# EAGLE design main_brd (EAGLE 6.4)
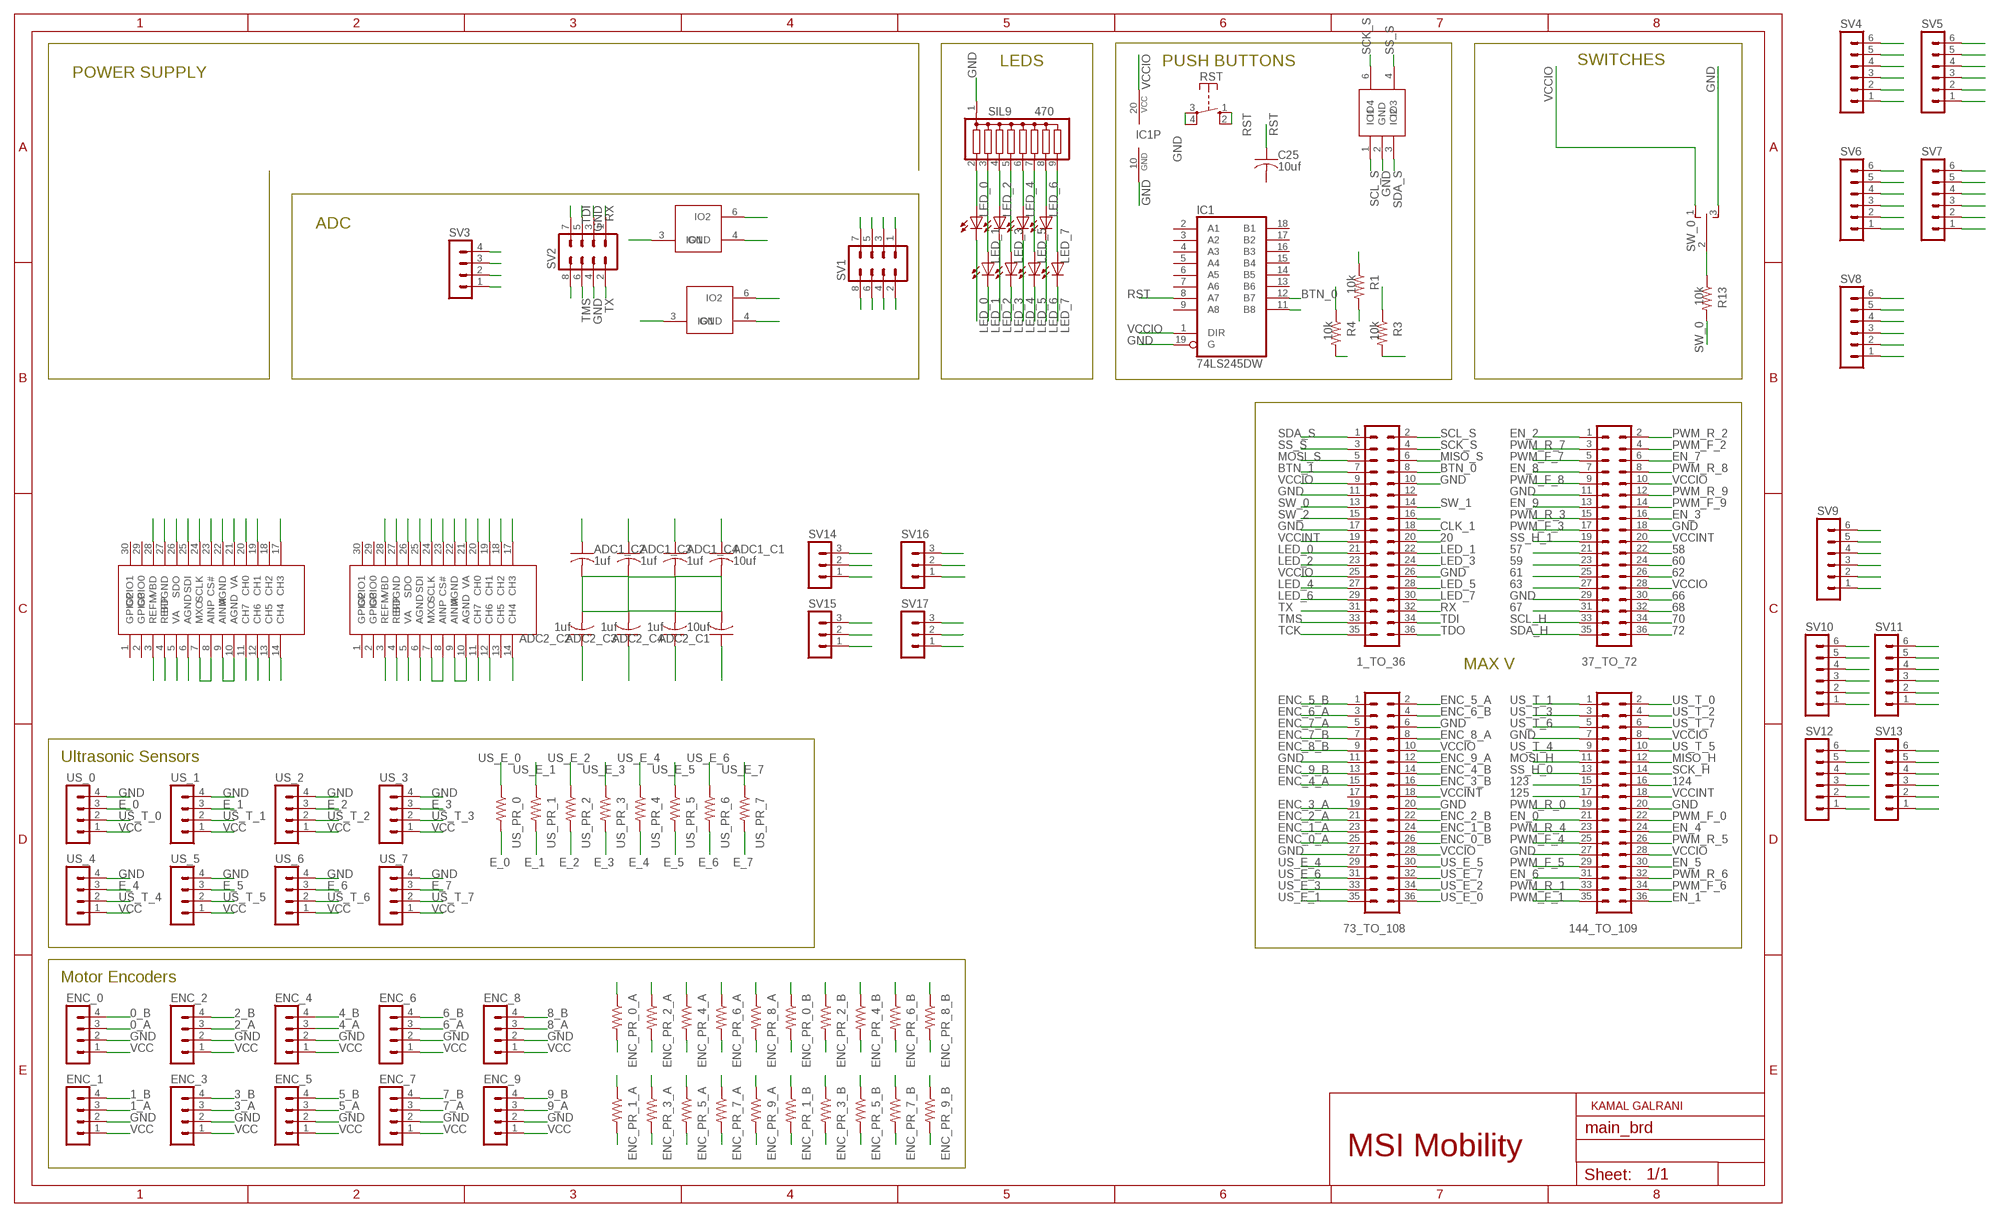
[diagram p0: schematic, sheet 1, part 1 of 2]
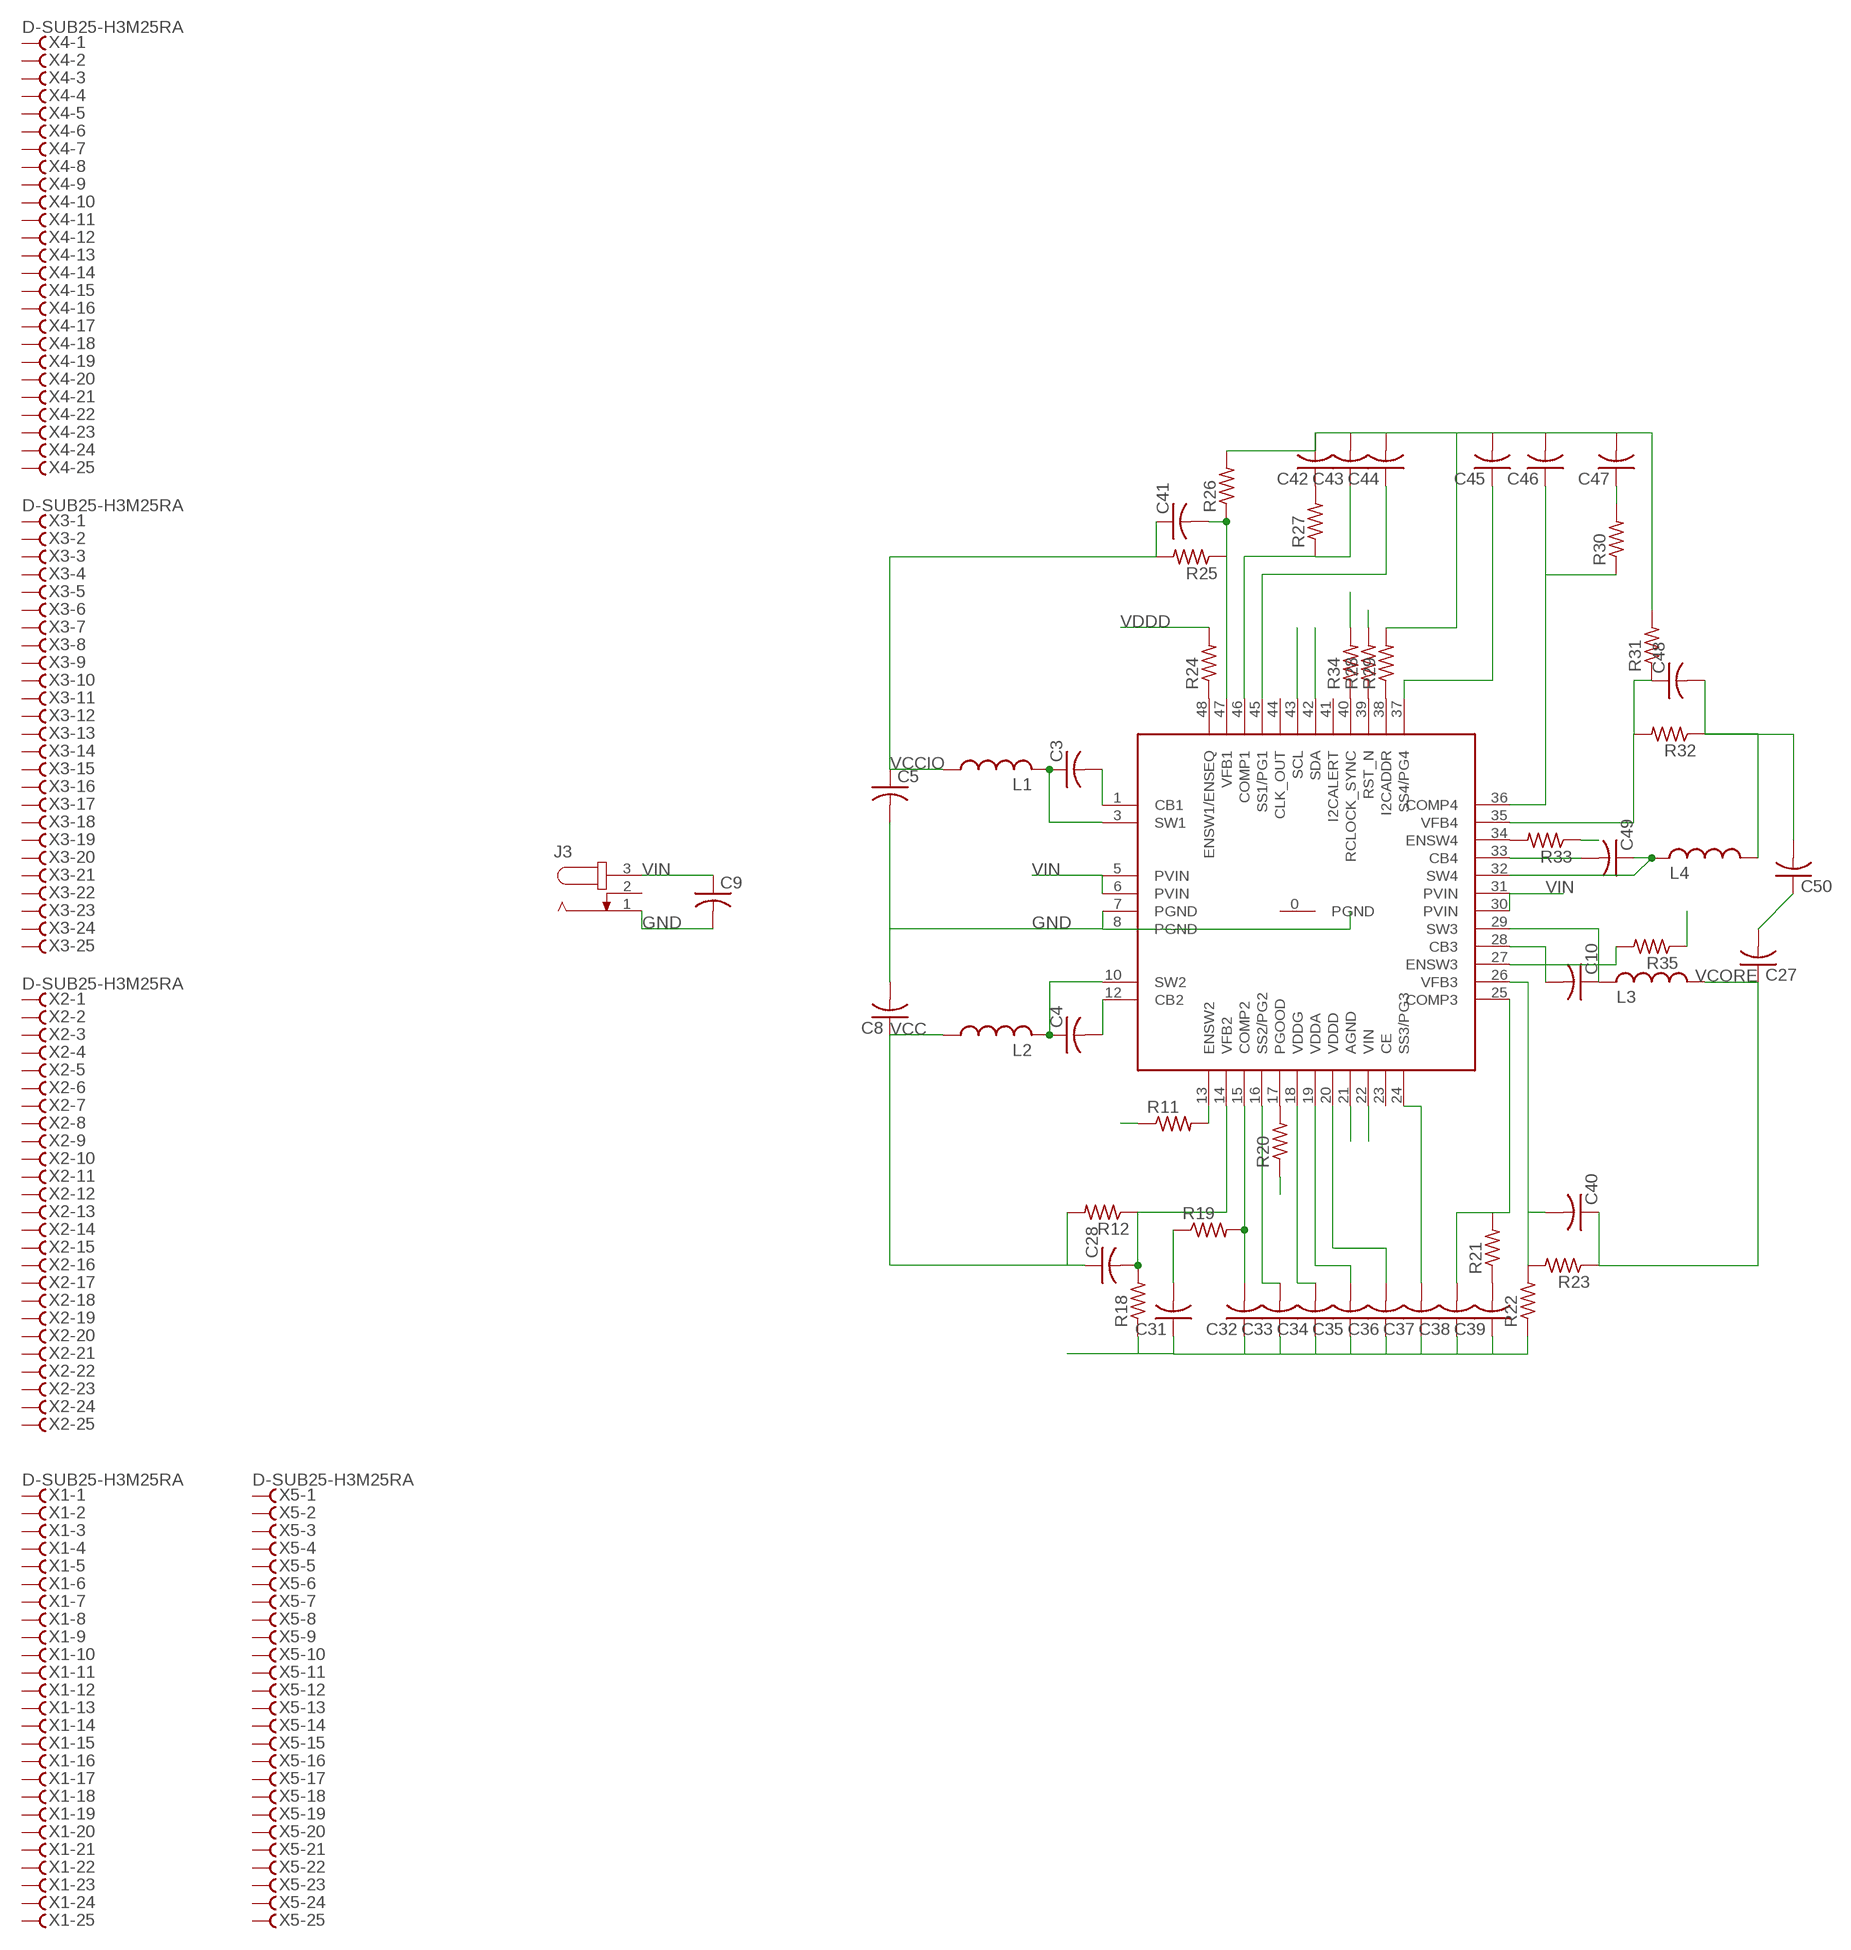
[diagram p1: schematic, sheet 1, part 2 of 2]

## Parts
1_TO_36  MA18-2  [MA18-2]
37_TO_72  MA18-2  [MA18-2]
73_TO_108  MA18-2  [MA18-2]
144_TO_109  MA18-2  [MA18-2]
ADC1_C1  10uf  C-USC1206  [C1206]
ADC1_C2  1uf  C-USC1206  [C1206]
ADC1_C3  1uf  C-USC1206  [C1206]
ADC1_C4  1uf  C-USC1206  [C1206]
ADC2_C1  10uf  C-USC1206  [C1206]
ADC2_C2  1uf  C-USC1206  [C1206]
ADC2_C3  1uf  C-USC1206  [C1206]
ADC2_C4  1uf  C-USC1206  [C1206]
C3  C-USC1206  [C1206]
C4  C-USC1206  [C1206]
C5  C-USC1206  [C1206]
C8  C-USC1206  [C1206]
C9  C-USC1206  [C1206]
C10  C-USC1206  [C1206]
C25  10uf  C-USC1206  [C1206]
C27  C-USC1206  [C1206]
C28  C-USC1206  [C1206]
C31  C-USC1206  [C1206]
C32  C-USC1206  [C1206]
C33  C-USC1206  [C1206]
C34  C-USC1206  [C1206]
C35  C-USC1206  [C1206]
C36  C-USC1206  [C1206]
C37  C-USC1206  [C1206]
C38  C-USC1206  [C1206]
C39  C-USC1206  [C1206]
C40  C-USC1206  [C1206]
C41  C-USC1206  [C1206]
C42  C-USC1206  [C1206]
C43  C-USC1206  [C1206]
C44  C-USC1206  [C1206]
C45  C-USC1206  [C1206]
C46  C-USC1206  [C1206]
C47  C-USC1206  [C1206]
C48  C-USC1206  [C1206]
C49  C-USC1206  [C1206]
C50  C-USC1206  [C1206]
ENC_0  MA04-1  [MA04-1]
ENC_1  MA04-1  [MA04-1]
ENC_2  MA04-1  [MA04-1]
ENC_3  MA04-1  [MA04-1]
ENC_4  MA04-1  [MA04-1]
ENC_5  MA04-1  [MA04-1]
ENC_6  MA04-1  [MA04-1]
ENC_7  MA04-1  [MA04-1]
ENC_8  MA04-1  [MA04-1]
ENC_9  MA04-1  [MA04-1]
ENC_PR_0_A  R-US_R1206  [R1206]
ENC_PR_0_B  R-US_R1206  [R1206]
ENC_PR_1_A  R-US_R1206  [R1206]
ENC_PR_1_B  R-US_R1206  [R1206]
ENC_PR_2_A  R-US_R1206  [R1206]
ENC_PR_2_B  R-US_R1206  [R1206]
ENC_PR_3_A  R-US_R1206  [R1206]
ENC_PR_3_B  R-US_R1206  [R1206]
ENC_PR_4_A  R-US_R1206  [R1206]
ENC_PR_4_B  R-US_R1206  [R1206]
ENC_PR_5_A  R-US_R1206  [R1206]
ENC_PR_5_B  R-US_R1206  [R1206]
ENC_PR_6_A  R-US_R1206  [R1206]
ENC_PR_6_B  R-US_R1206  [R1206]
ENC_PR_7_A  R-US_R1206  [R1206]
ENC_PR_7_B  R-US_R1206  [R1206]
ENC_PR_8_A  R-US_R1206  [R1206]
ENC_PR_8_B  R-US_R1206  [R1206]
ENC_PR_9_A  R-US_R1206  [R1206]
ENC_PR_9_B  R-US_R1206  [R1206]
IC1  74LS245DW  [SO20W]
J3  JACK-PLUG0  [SPC4077]
L1  L-USL1206  [C1206]
L2  L-USL1206  [C1206]
L3  L-USL1206  [C1206]
L4  L-USL1206  [C1206]
LED_0  LEDSMT1206  [1206]
LED_1  LEDSMT1206  [1206]
LED_2  LEDSMT1206  [1206]
LED_3  LEDSMT1206  [1206]
LED_4  LEDSMT1206  [1206]
LED_5  LEDSMT1206  [1206]
LED_6  LEDSMT1206  [1206]
LED_7  LEDSMT1206  [1206]
R1  10k  R-US_R1206  [R1206]
R3  10k  R-US_R1206  [R1206]
R4  10k  R-US_R1206  [R1206]
R11  R-US_R1206  [R1206]
R12  R-US_R1206  [R1206]
R13  10k  R-US_R1206  [R1206]
R18  R-US_R1206  [R1206]
R19  R-US_R1206  [R1206]
R20  R-US_R1206  [R1206]
R21  R-US_R1206  [R1206]
R22  R-US_R1206  [R1206]
R23  R-US_R1206  [R1206]
R24  R-US_R1206  [R1206]
R25  R-US_R1206  [R1206]
R26  R-US_R1206  [R1206]
R27  R-US_R1206  [R1206]
R28  R-US_R1206  [R1206]
R29  R-US_R1206  [R1206]
R30  R-US_R1206  [R1206]
R31  R-US_R1206  [R1206]
R32  R-US_R1206  [R1206]
R33  R-US_R1206  [R1206]
R34  R-US_R1206  [R1206]
R35  R-US_R1206  [R1206]
RST  RACON12  [RACON12]
SIL9  470  G08R  [SIL9]
SV1  MA04-2  [MA04-2]
SV2  MA04-2  [MA04-2]
SV3  MA04-1  [MA04-1]
SV4  MA06-1  [MA06-1]
SV5  MA06-1  [MA06-1]
SV6  MA06-1  [MA06-1]
SV7  MA06-1  [MA06-1]
SV8  MA06-1  [MA06-1]
SV9  MA06-1  [MA06-1]
SV10  MA06-1  [MA06-1]
SV11  MA06-1  [MA06-1]
SV12  MA06-1  [MA06-1]
SV13  MA06-1  [MA06-1]
SV14  MA03-1  [MA03-1]
SV15  MA03-1  [MA03-1]
SV16  MA03-1  [MA03-1]
SV17  MA03-1  [MA03-1]
SW_0  TL39PO  [TL3XPO]
U$1  TPD4E1B06DCKR  [DCK6]
U$2  TPS65400RGZR  [VQFN48]
U$3  ADS7955-Q1-DBTR  [DBT_R-PDSO-G30]
U$4  TPD2E2U06DRLR  [DRL5]
U$5  TPD2E2U06DRLR  [DRL5]
U$6  ADS7955-Q1-DBTR  [DBT_R-PDSO-G30]
US_0  MA04-1  [MA04-1]
US_1  MA04-1  [MA04-1]
US_2  MA04-1  [MA04-1]
US_3  MA04-1  [MA04-1]
US_4  MA04-1  [MA04-1]
US_5  MA04-1  [MA04-1]
US_6  MA04-1  [MA04-1]
US_7  MA04-1  [MA04-1]
US_PR_0  R-US_R1206  [R1206]
US_PR_1  R-US_R1206  [R1206]
US_PR_2  R-US_R1206  [R1206]
US_PR_3  R-US_R1206  [R1206]
US_PR_4  R-US_R1206  [R1206]
US_PR_5  R-US_R1206  [R1206]
US_PR_6  R-US_R1206  [R1206]
US_PR_7  R-US_R1206  [R1206]
X1  D-SUB25-H3M25RA  [H3M25RA]
X2  D-SUB25-H3M25RA  [H3M25RA]
X3  D-SUB25-H3M25RA  [H3M25RA]
X4  D-SUB25-H3M25RA  [H3M25RA]
X5  D-SUB25-H3M25RA  [H3M25RA]

## Nets
0_A: ENC_0.3 ENC_PR_0_A.2
0_B: ENC_0.4 ENC_PR_0_B.2
1_A: ENC_1.3 ENC_PR_1_A.2
1_B: ENC_1.4 ENC_PR_1_B.2
2_A: ENC_2.3 ENC_PR_2_A.2
2_B: ENC_2.4 ENC_PR_2_B.2
3_A: ENC_3.3 ENC_PR_3_A.2
3_B: ENC_3.4 ENC_PR_3_B.2
4_A: ENC_4.3 ENC_PR_4_A.2
4_B: ENC_4.4 ENC_PR_4_B.2
5_A: ENC_5.3 ENC_PR_5_A.2
5_B: ENC_5.4 ENC_PR_5_B.2
6_A: ENC_6.3 ENC_PR_6_A.2
6_B: ENC_6.4 ENC_PR_6_B.2
7_A: ENC_7.3 ENC_PR_7_A.2
7_B: ENC_7.4 ENC_PR_7_B.2
8_A: ENC_8.3 ENC_PR_8_A.2
8_B: ENC_8.4 ENC_PR_8_B.2
9_A: ENC_9.3 ENC_PR_9_A.2
9_B: ENC_9.4 ENC_PR_9_B.2
20: 1_TO_36.20
57: 37_TO_72.21
58: 37_TO_72.22
59: 37_TO_72.23
60: 37_TO_72.24
61: 37_TO_72.25
62: 37_TO_72.26
63: 37_TO_72.27
66: 37_TO_72.30
67: 37_TO_72.31
68: 37_TO_72.32
70: 37_TO_72.34
72: 37_TO_72.36
123: 144_TO_109.15
124: 144_TO_109.16
125: 144_TO_109.17
BTN: U$4.6(IO2)
BTN_0: 1_TO_36.8 IC1.12(B7)
BTN_1: 1_TO_36.7 IC1.11(B8)
CLK_1: 1_TO_36.18
CS_0: SV9.4 U$3.11(CH7)
CS_1: SV13.4 U$3.17(CH3)
CS_2: SV4.4 U$6.14(CH4)
CS_3: SV8.4 U$6.20(CH0)
CS_4: SV10.4 U$3.12(CH6)
CS_5: SV11.4 U$3.13(CH5)
CS_6: SV12.4 U$3.14(CH4)
CS_7: SV5.4 U$6.17(CH3)
CS_8: SV6.4 U$6.18(CH2)
CS_9: SV7.4 U$6.19(CH1)
E_0: US_0.3 US_PR_0.2
E_1: US_1.3 US_PR_1.2
E_2: US_2.3 US_PR_2.2
E_3: US_3.3 US_PR_3.2
E_4: US_4.3 US_PR_4.2
E_5: US_5.3 US_PR_5.2
E_6: US_6.3 US_PR_6.2
E_7: US_7.3 US_PR_7.2
EN_0: 144_TO_109.21 SV9.2
EN_1: 144_TO_109.36 SV13.2
EN_2: 37_TO_72.1 SV4.2
EN_3: 37_TO_72.16 SV8.2
EN_4: 144_TO_109.24 SV10.2
EN_5: 144_TO_109.30 SV11.2
EN_6: 144_TO_109.31 SV12.2
EN_7: 37_TO_72.6 SV5.2
EN_8: 37_TO_72.7 SV6.2
EN_9: 37_TO_72.13 SV7.2
ENC_0_A: 73_TO_108.25 ENC_PR_0_A.1
ENC_0_B: 73_TO_108.26 ENC_PR_0_B.1
ENC_1_A: 73_TO_108.23 ENC_PR_1_A.1
ENC_1_B: 73_TO_108.24 ENC_PR_1_B.1
ENC_2_A: 73_TO_108.21 ENC_PR_2_A.1
ENC_2_B: 73_TO_108.22 ENC_PR_2_B.1
ENC_3_A: 73_TO_108.19 ENC_PR_3_A.1
ENC_3_B: 73_TO_108.16 ENC_PR_3_B.1
ENC_4_A: 73_TO_108.15 ENC_PR_4_A.1
ENC_4_B: 73_TO_108.14 ENC_PR_4_B.1
ENC_5_A: 73_TO_108.2 ENC_PR_5_A.1
ENC_5_B: 73_TO_108.1 ENC_PR_5_B.1
ENC_6_A: 73_TO_108.3 ENC_PR_6_A.1
ENC_6_B: 73_TO_108.4 ENC_PR_6_B.1
ENC_7_A: 73_TO_108.5 ENC_PR_7_A.1
ENC_7_B: 73_TO_108.7 ENC_PR_7_B.1
ENC_8_A: 73_TO_108.8 ENC_PR_8_A.1
ENC_8_B: 73_TO_108.9 ENC_PR_8_B.1
ENC_9_A: 73_TO_108.12 ENC_PR_9_A.1
ENC_9_B: 73_TO_108.13 ENC_PR_9_B.1
ENSW3: R35.2 U$2.27(ENSW3)
ENSW4: R33.2 U$2.34(ENSW4)
GND: 1_TO_36.10 1_TO_36.11 1_TO_36.17 1_TO_36.26 37_TO_72.11 37_TO_72.18 37_TO_72.29 73_TO_108.6 73_TO_108.11 73_TO_108.20 73_TO_108.27 144_TO_109.7 144_TO_109.20 144_TO_109.27 ADC1_C1.2 ADC1_C2.2 ADC1_C3.2 ADC1_C4.2 ADC2_C1.2 ADC2_C2.2 ADC2_C3.2 ADC2_C4.2 C5.2 C8.2 C9.2 C27.2 C31.1 C32.1 C33.1 C34.1 C35.1 C36.1 C37.1 C38.1 C39.1 C42.2 C43.2 C44.2 C45.2 C46.2 C47.2 ENC_0.2 ENC_1.2 ENC_2.2 ENC_3.2 ENC_4.2 ENC_5.2 ENC_6.2 ENC_7.2 ENC_8.2 ENC_9.2 IC1.10(GND) IC1.19(G) J3.1 R18.1 R22.1 R26.2 R29.2 R31.2 R34.2 RST.3(P) RST.4(P) SIL9.1 SV1.7 SV1.8 SV2.3 SV2.4 SV3.2 SV14.3 SV15.3 SV16.3 SV17.3 SW_0.3(S) U$1.2(GND) U$2.7(PGND) U$2.8(PGND) U$2.21(AGND) U$3.3(REFM) U$3.6(AGND) U$3.9(AINM) U$3.10(AGND) U$3.22(AGND) U$3.27(BDGND) U$4.4(GND) U$5.4(GND) U$6.3(REFM) U$6.6(AGND) U$6.9(AINM) U$6.10(AGND) U$6.22(AGND) U$6.27(BDGND) US_0.4 US_1.4 US_2.4 US_3.4 US_4.4 US_5.4 US_6.4 US_7.4
LED_0: 1_TO_36.21 LED_0.C
LED_1: 1_TO_36.22 LED_1.C
LED_2: 1_TO_36.23 LED_2.C
LED_3: 1_TO_36.24 LED_3.C
LED_4: 1_TO_36.27 LED_4.C
LED_5: 1_TO_36.28 LED_5.C
LED_6: 1_TO_36.29 LED_6.C
LED_7: 1_TO_36.30 LED_7.C
MISO_H: 144_TO_109.12 U$3.26(SDO) U$6.26(SDO)
MISO_S: 1_TO_36.6 SV1.5 U$5.3(IO1)
MOSI_H: 144_TO_109.11 U$3.25(SDI) U$6.25(SDI)
MOSI_S: 1_TO_36.5 SV1.6 U$5.6(IO2)
MXO_0: U$3.7(MXO) U$3.8(AINP)
MXO_1: U$6.7(MXO) U$6.8(AINP)
N$1: SV13.6
N$3: C4.1 L2.2 U$2.10(SW2)
N$4: SV4.6
N$5: SV11.6
N$8: SV12.6
N$10: C3.2 U$2.1(CB1)
N$11: C3.1 L1.2 U$2.3(SW1)
N$12: C4.2 U$2.12(CB2)
N$13: C10.1 L3.2 U$2.29(SW3)
N$14: C10.2 U$2.28(CB3)
N$16: R11.2 U$2.13(ENSW2)
N$17: C28.2 R12.1 R18.2 U$2.14(VFB2)
N$18: C32.2 R19.2 U$2.15(COMP2)
N$19: LED_0.A SIL9.2
N$21: LED_4.A SIL9.6
N$22: LED_6.A SIL9.8
N$23: LED_1.A SIL9.3
N$24: LED_3.A SIL9.5
N$25: LED_5.A SIL9.7
N$26: LED_7.A SIL9.9
N$27: C31.2 R19.1
N$28: R13.1 SW_0.2(P)
N$29: R20.2 U$2.17(PGOOD)
N$35: C34.2 U$2.18(VDDG)
N$36: C35.2 U$2.19(VDDA)
N$37: C39.2 R21.1
N$38: C40.2 R22.2 R23.2 U$2.26(VFB3)
N$39: C38.2 R21.2 U$2.25(COMP3)
N$40: R24.1 U$2.48(ENSW1/ENSEQ)
N$41: C37.2 U$2.24(SS3/PG3)
N$44: C33.2 U$2.16(SS2/PG2)
N$47: C42.1 R27.2
N$48: SV8.6
N$54: R29.1 U$2.38(I2CADDR)
N$55: C48.1 R31.1 R32.2 U$2.35(VFB4)
N$57: C49.1 L4.2 U$2.32(SW4)
N$58: C41.2 R25.1 R26.1 U$2.47(VFB1)
N$59: C45.1 U$2.37(SS4/PG4)
N$60: C46.1 R30.1 U$2.36(COMP4)
N$61: C47.1 R30.2
N$62: C43.1 R27.1 U$2.46(COMP1)
N$63: C44.1 U$2.45(SS1/PG1)
N$64: SV9.6
N$65: C49.2 U$2.33(CB4)
N$66: R34.1 U$2.40(RCLOCK_SYNC)
N$69: SV6.6
N$72: SV10.6
N$82: SV7.6
N$88: SV5.6
POT_0: SV14.2 U$3.20(CH0)
POT_1: SV15.2 U$3.19(CH1)
POT_2: SV16.2 U$6.11(CH7)
POT_3: SV17.2 U$6.12(CH6)
PWM_F_0: 144_TO_109.22 SV9.1
PWM_F_1: 144_TO_109.35 SV13.1
PWM_F_2: 37_TO_72.4 SV4.1
PWM_F_3: 37_TO_72.17 SV8.1
PWM_F_4: 144_TO_109.25 SV10.1
PWM_F_5: 144_TO_109.29 SV11.1
PWM_F_6: 144_TO_109.34 SV12.1
PWM_F_7: 37_TO_72.5 SV5.1
PWM_F_8: 37_TO_72.9 SV6.1
PWM_F_9: 37_TO_72.14 SV7.1
PWM_R_0: 144_TO_109.19 SV9.3
PWM_R_1: 144_TO_109.33 SV13.3
PWM_R_2: 37_TO_72.2 SV4.3
PWM_R_3: 37_TO_72.15 SV8.3
PWM_R_4: 144_TO_109.23 SV10.3
PWM_R_5: 144_TO_109.26 SV11.3
PWM_R_6: 144_TO_109.32 SV12.3
PWM_R_7: 37_TO_72.3 SV5.3
PWM_R_8: 37_TO_72.8 SV6.3
PWM_R_9: 37_TO_72.12 SV7.3
REFP_0: ADC1_C1.1 U$3.4(REFP)
REFP_1: ADC2_C1.1 U$6.4(REFP)
RST: C25.1 IC1.8(A7) R1.1 RST.1(S) RST.2(S) U$4.3(IO1)
RST_N: R28.1 U$2.39(RST_N)
RX: 1_TO_36.32 SV2.1 SV3.3
SCK_H: 144_TO_109.14 U$3.24(SCLK) U$6.24(SCLK)
SCK_S: 1_TO_36.4 SV1.3 U$1.6(IO4)
SCL_H: 37_TO_72.33
SCL_S: 1_TO_36.2 R4.1 SV1.1 U$1.1(IO1) U$2.43(SCL)
SDA_H: 37_TO_72.35
SDA_S: 1_TO_36.1 R3.1 SV1.2 U$1.3(IO2) U$2.42(SDA)
SIL10: LED_2.A SIL9.4
SS_H_0: 144_TO_109.13 U$3.23(CS#)
SS_H_1: 37_TO_72.19 U$6.23(CS#)
SS_S: 1_TO_36.3 SV1.4 U$1.4(IO3)
SW_0: 1_TO_36.13 R13.2
SW_1: 1_TO_36.14
SW_2: 1_TO_36.15
SW_3: 1_TO_36.16
TCK: 1_TO_36.35 SV2.8
TDI: 1_TO_36.34 SV2.5
TDO: 1_TO_36.36 SV2.7
TMS: 1_TO_36.33 SV2.6
TX: 1_TO_36.31 SV2.2 SV3.1
US_E_0: 73_TO_108.36 US_PR_0.1
US_E_1: 73_TO_108.35 US_PR_1.1
US_E_2: 73_TO_108.34 US_PR_2.1
US_E_3: 73_TO_108.33 US_PR_3.1
US_E_4: 73_TO_108.29 US_PR_4.1
US_E_5: 73_TO_108.30 US_PR_5.1
US_E_6: 73_TO_108.31 US_PR_6.1
US_E_7: 73_TO_108.32 US_PR_7.1
US_T_0: 144_TO_109.2 US_0.2
US_T_1: 144_TO_109.1 US_1.2
US_T_2: 144_TO_109.4 US_2.2
US_T_3: 144_TO_109.3 US_3.2
US_T_4: 144_TO_109.9 US_4.2
US_T_5: 144_TO_109.10 US_5.2
US_T_6: 144_TO_109.5 US_6.2
US_T_7: 144_TO_109.6 US_7.2
VCC: ADC1_C2.1 ADC1_C3.1 ADC2_C2.1 ADC2_C3.1 C8.1 C28.1 ENC_0.1 ENC_1.1 ENC_2.1 ENC_3.1 ENC_4.1 ENC_5.1 ENC_6.1 ENC_7.1 ENC_8.1 ENC_9.1 L2.1 R12.2 SV14.1 SV15.1 SV16.1 SV17.1 U$3.5(VA) U$3.21(VA) U$6.5(VA) U$6.21(VA) US_0.1 US_1.1 US_2.1 US_3.1 US_4.1 US_5.1 US_6.1 US_7.1
VCCINT: 1_TO_36.19 37_TO_72.20 73_TO_108.18 144_TO_109.18 C48.2 C50.2 L4.1 R32.1
VCCIO: 1_TO_36.9 1_TO_36.25 37_TO_72.10 37_TO_72.28 73_TO_108.10 73_TO_108.28 144_TO_109.8 144_TO_109.28 ADC1_C4.1 ADC2_C4.1 C5.1 C41.1 IC1.1(DIR) IC1.20(VCC) L1.1 R1.2 R3.2 R4.2 R25.2 SV3.4 SV4.5 SV5.5 SV6.5 SV7.5 SV8.5 SV9.5 SV10.5 SV11.5 SV12.5 SV13.5 SW_0.1(O) U$3.28(VBD) U$6.28(VBD)
VCORE: C27.1 C40.1 L3.1 R23.1
VDDD: C36.2 R11.1 R20.1 R24.2 R28.2 R33.1 R35.1 U$2.20(VDDD)
VIN: C9.1 J3.3 U$2.5(PVIN) U$2.6(PVIN) U$2.22(VIN) U$2.30(PVIN) U$2.31(PVIN)
Unconnected: 1_TO_36.12 73_TO_108.17 C25.2 C50.1 IC1.2(A1) IC1.3(A2) IC1.4(A3) IC1.5(A4) IC1.6(A5) IC1.7(A6) IC1.9(A8) IC1.13(B6) IC1.14(B5) IC1.15(B4) IC1.16(B3) IC1.17(B2) IC1.18(B1) J3.2 U$2.0(PGND) U$2.23(CE) U$2.41(I2CALERT) U$2.44(CLK_OUT) U$3.1(GPIO2) U$3.2(GPIO3) U$3.18(CH2) U$3.29(GPIO0) U$3.30(GPIO1) U$6.1(GPIO2) U$6.2(GPIO3) U$6.13(CH5) U$6.29(GPIO0) U$6.30(GPIO1) X1.1 X1.2 X1.3 X1.4 X1.5 X1.6 X1.7 X1.8 X1.9 X1.10 X1.11 X1.12 X1.13 X1.14 X1.15 X1.16 X1.17 X1.18 X1.19 X1.20 X1.21 X1.22 X1.23 X1.24 X1.25 X2.1 X2.2 X2.3 X2.4 X2.5 X2.6 X2.7 X2.8 X2.9 X2.10 X2.11 X2.12 X2.13 X2.14 X2.15 X2.16 X2.17 X2.18 X2.19 X2.20 X2.21 X2.22 X2.23 X2.24 X2.25 X3.1 X3.2 X3.3 X3.4 X3.5 X3.6 X3.7 X3.8 X3.9 X3.10 X3.11 X3.12 X3.13 X3.14 X3.15 X3.16 X3.17 X3.18 X3.19 X3.20 X3.21 X3.22 X3.23 X3.24 X3.25 X4.1 X4.2 X4.3 X4.4 X4.5 X4.6 X4.7 X4.8 X4.9 X4.10 X4.11 X4.12 X4.13 X4.14 X4.15 X4.16 X4.17 X4.18 X4.19 X4.20 X4.21 X4.22 X4.23 X4.24 X4.25 X5.1 X5.2 X5.3 X5.4 X5.5 X5.6 X5.7 X5.8 X5.9 X5.10 X5.11 X5.12 X5.13 X5.14 X5.15 X5.16 X5.17 X5.18 X5.19 X5.20 X5.21 X5.22 X5.23 X5.24 X5.25

## Notes on the sheet
- LEDS | PUSH BUTTONS | SWITCHES
- POWER SUPPLY
- ADC
- MAX V
- Ultrasonic Sensors
- Motor Encoders
- KAMAL GALRANI
- MSI Mobility

## Library data of the parts
1_TO_36 37_TO_72 73_TO_108 144_TO_109 = con-lstb:MA18-2: PIN HEADER; OC_FARNELL: unknown; OC_NEWARK: unknown
ADC1_C1-ADC1_C4 ADC2_C1-ADC2_C4 C25 = resistor:C-US: CAPACITOR, American symbol
C3-C5 C8-C10 C27 C28 C31-C50 = rcl:C-US: CAPACITOR, American symbol
ENC_0 ENC_1-ENC_9 SV3 US_0 US_1-US_7 = con-lstb:MA04-1: PIN HEADER; OC_FARNELL: unknown; OC_NEWARK: unknown
ENC_PR_0_A ENC_PR_0_B ENC_PR_1_A ENC_PR_1_B ENC_PR_2_A ENC_PR_2_B ENC_PR_3_A ENC_PR_3_B ENC_PR_4_A ENC_PR_4_B ENC_PR_5_A ENC_PR_5_B ENC_PR_6_A ENC_PR_6_B ENC_PR_7_A ENC_PR_7_B ENC_PR_8_A ENC_PR_8_B ENC_PR_9_A ENC_PR_9_B R1 R3 R4 R13 US_PR_0 US_PR_1-US_PR_7 = resistor:R-US_: RESISTOR, American symbol
IC1 = 74xx-us:74*245: Octal BUS TRANSCEIVER, 3-state
J3 = con-jack:JACK-PLUG: DC POWER JACK Power Jack, DC, Right Angle, Through Hole, Rated 5A at 16VDC, PC Terminals Distributor: Farnell (www.Farnell.de) Drawing: 84N1161.pdf / 84N1162.pdf Manufacturer: SPC Technology (www.spctechnology.com) Type: SPC4077 / SPC 4078; OC_FARNELL: unknown; OC_NEWARK: unknown
L1-L4 = rcl:L-US: INDUCTOR, American symbol
LED_0 LED_1-LED_7 = led:LED: LED OSRAM: - CHIPLED LG R971, LG N971, LY N971, LG Q971, LY Q971, LO R971, LY R971 LH N974, LH R974 LS Q976, LO Q976, LY Q976 LO Q996 - Hyper CHIPLED LW Q18S LB Q993, LB Q99A, LB R99A - SideLED LS A670, LO A670, LY A670, LG A670, LP A670 LB A673, LV A673, LT A673, LW A673 LH A674 LY A675 LS A676, LA A676, LO A676, LY A676, LW A676 LS A679, LY A679, LG A679 - Hyper Micro SIDELED® LS Y876, LA Y876, LO Y876, LY Y876 LT Y87S - SmartLED LW L88C, LW L88S LB L89C, LB L89S, LG L890 LS L89K, LO L89K, LY L89K LS L896, LA L896, LO L896, LY L896 - TOPLED LS T670, LO T670, LY T670, LG T670, LP T670 LSG T670, LSP T670, LSY T670, LOP T670, LYG T670 LG T671, LOG T671, LSG T671 LB T673, LV T673, LT T673, LW T673 LH T674 LS T676, LA T676, LO T676, LY T676, LB T676, LH T676, LSB T676, LW T676 LB T67C, LV T67C, LT T67C, LS T67K, LO T67K, LY T67K, LW E67C LS E67B, LA E67B, LO E67B, LY E67B, LB E67C, LV E67C, LT E67C LW T67C LS T679, LY T679, LG T679 LS T770, LO T770, LY T770, LG T770, LP T770 LB T773, LV T773, LT T773, LW T773 LH T774 LS E675, LA E675, LY E675, LS T675 LS T776, LA T776, LO T776, LY T776, LB T776 LHGB T686 LT T68C, LB T68C - Hyper Mini TOPLED® LB M676 - Mini TOPLED Santana® LG M470 LS M47K, LO M47K, LY M47K Source: http://www.osram.convergy.de - LUMILED® LXK2-PW12-R00, LXK2-PW12-S00, LXK2-PW14-U00, LXK2-PW14-V00 LXK2-PM12-R00, LXK2-PM12-S00, LXK2-PM14-U00 LXK2-PE12-Q00, LXK2-PE12-R00, LXK2-PE12-S00, LXK2-PE14-T00, LXK2-PE14-U00 LXK2-PB12-K00, LXK2-PB12-L00, LXK2-PB12-M00, LXK2-PB14-N00, LXK2-PB14-P00, LXK2-PB14-Q00 LXK2-PR12-L00, LXK2-PR12-M00, LXK2-PR14-Q00, LXK2-PR14-R00 LXK2-PD12-Q00, LXK2-PD12-R00, LXK2-PD12-S00 LXK2-PH12-R00, LXK2-PH12-S00 LXK2-PL12-P00, LXK2-PL12-Q00, LXK2-PL12-R00 Source: www.luxeon.com
R11 R12 R18-R35 = rcl:R-US_: RESISTOR, American symbol
RST = switch-misc:RACON12: ITT SWITCH
SIL9 = resistor-sil:G08R: SIL RESISTOR
SV1 SV2 = con-lstb:MA04-2: PIN HEADER; OC_FARNELL: unknown; OC_NEWARK: unknown
SV4-SV13 = con-lstb:MA06-1: PIN HEADER; OC_FARNELL: unknown; OC_NEWARK: unknown
SV14-SV17 = con-lstb:MA03-1: PIN HEADER; OC_FARNELL: unknown; OC_NEWARK: unknown
SW_0 = switch:TL39PO: TINY SWITCH ON OFF ON Source: http://www2.produktinfo.conrad.com/datenblaetter/700000-724999/705152-da-01-de-Subminiaturschalter_TL_36YO.pdf
U$1 = ti-esd:TPD4E1B06: Texas Intstruments ESD Protection Solutions
U$2 = ti-power:TPS65400: Quad 4A/4A/2A/2A buck converter
U$3 U$6 = kamal:ADS7955-Q1
U$4 U$5 = ti-esd:TPD2E2U06: Texas Intstruments ESD Protection Solutions
X1-X5 = con-thomas-betts:D-SUB25-: D-Subminiatur Connector Source: Electronioc Interconnects European Edition 1998; OC_FARNELL: unknown; OC_NEWARK: unknown

## Board
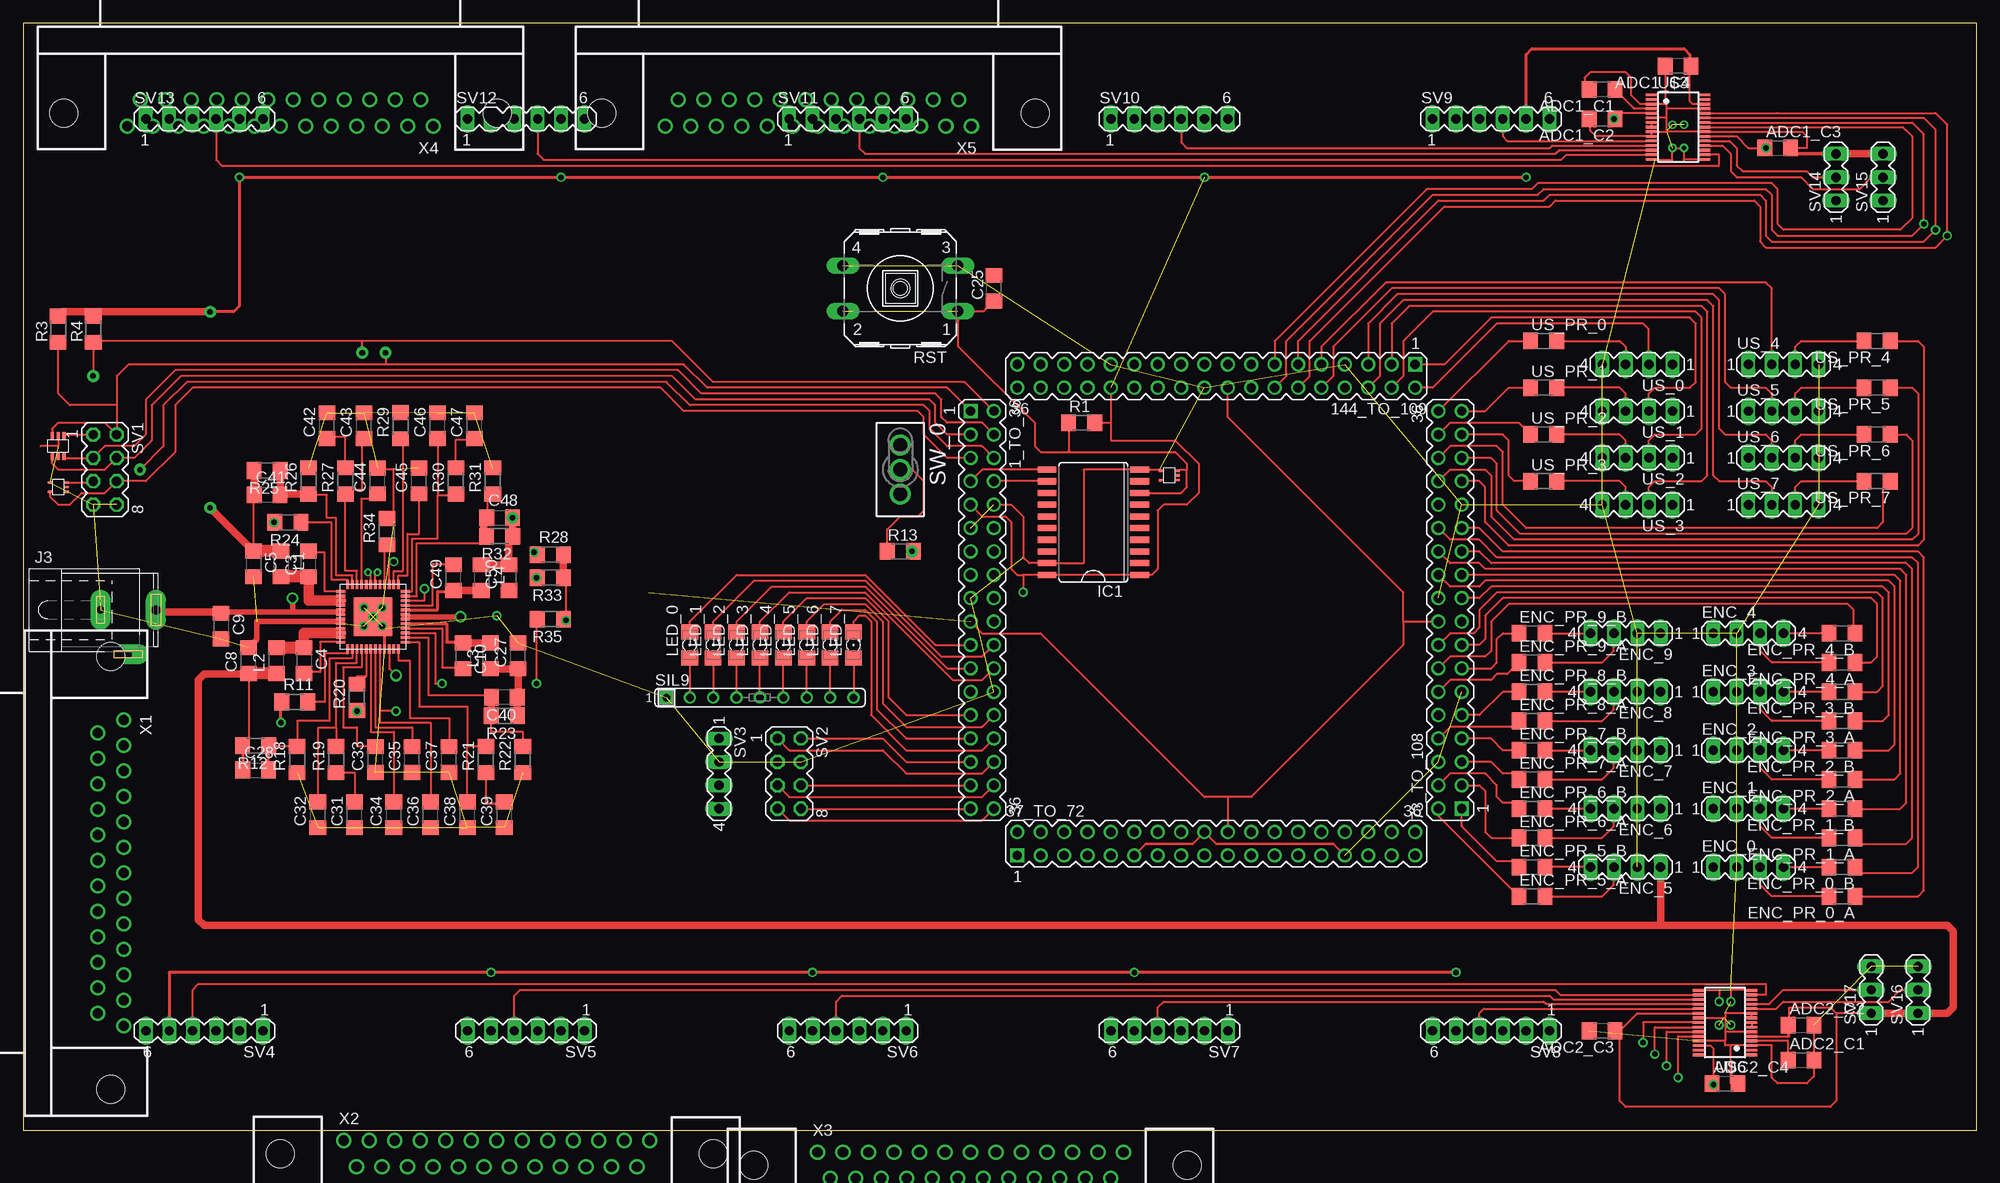
[diagram p2: board, top side]
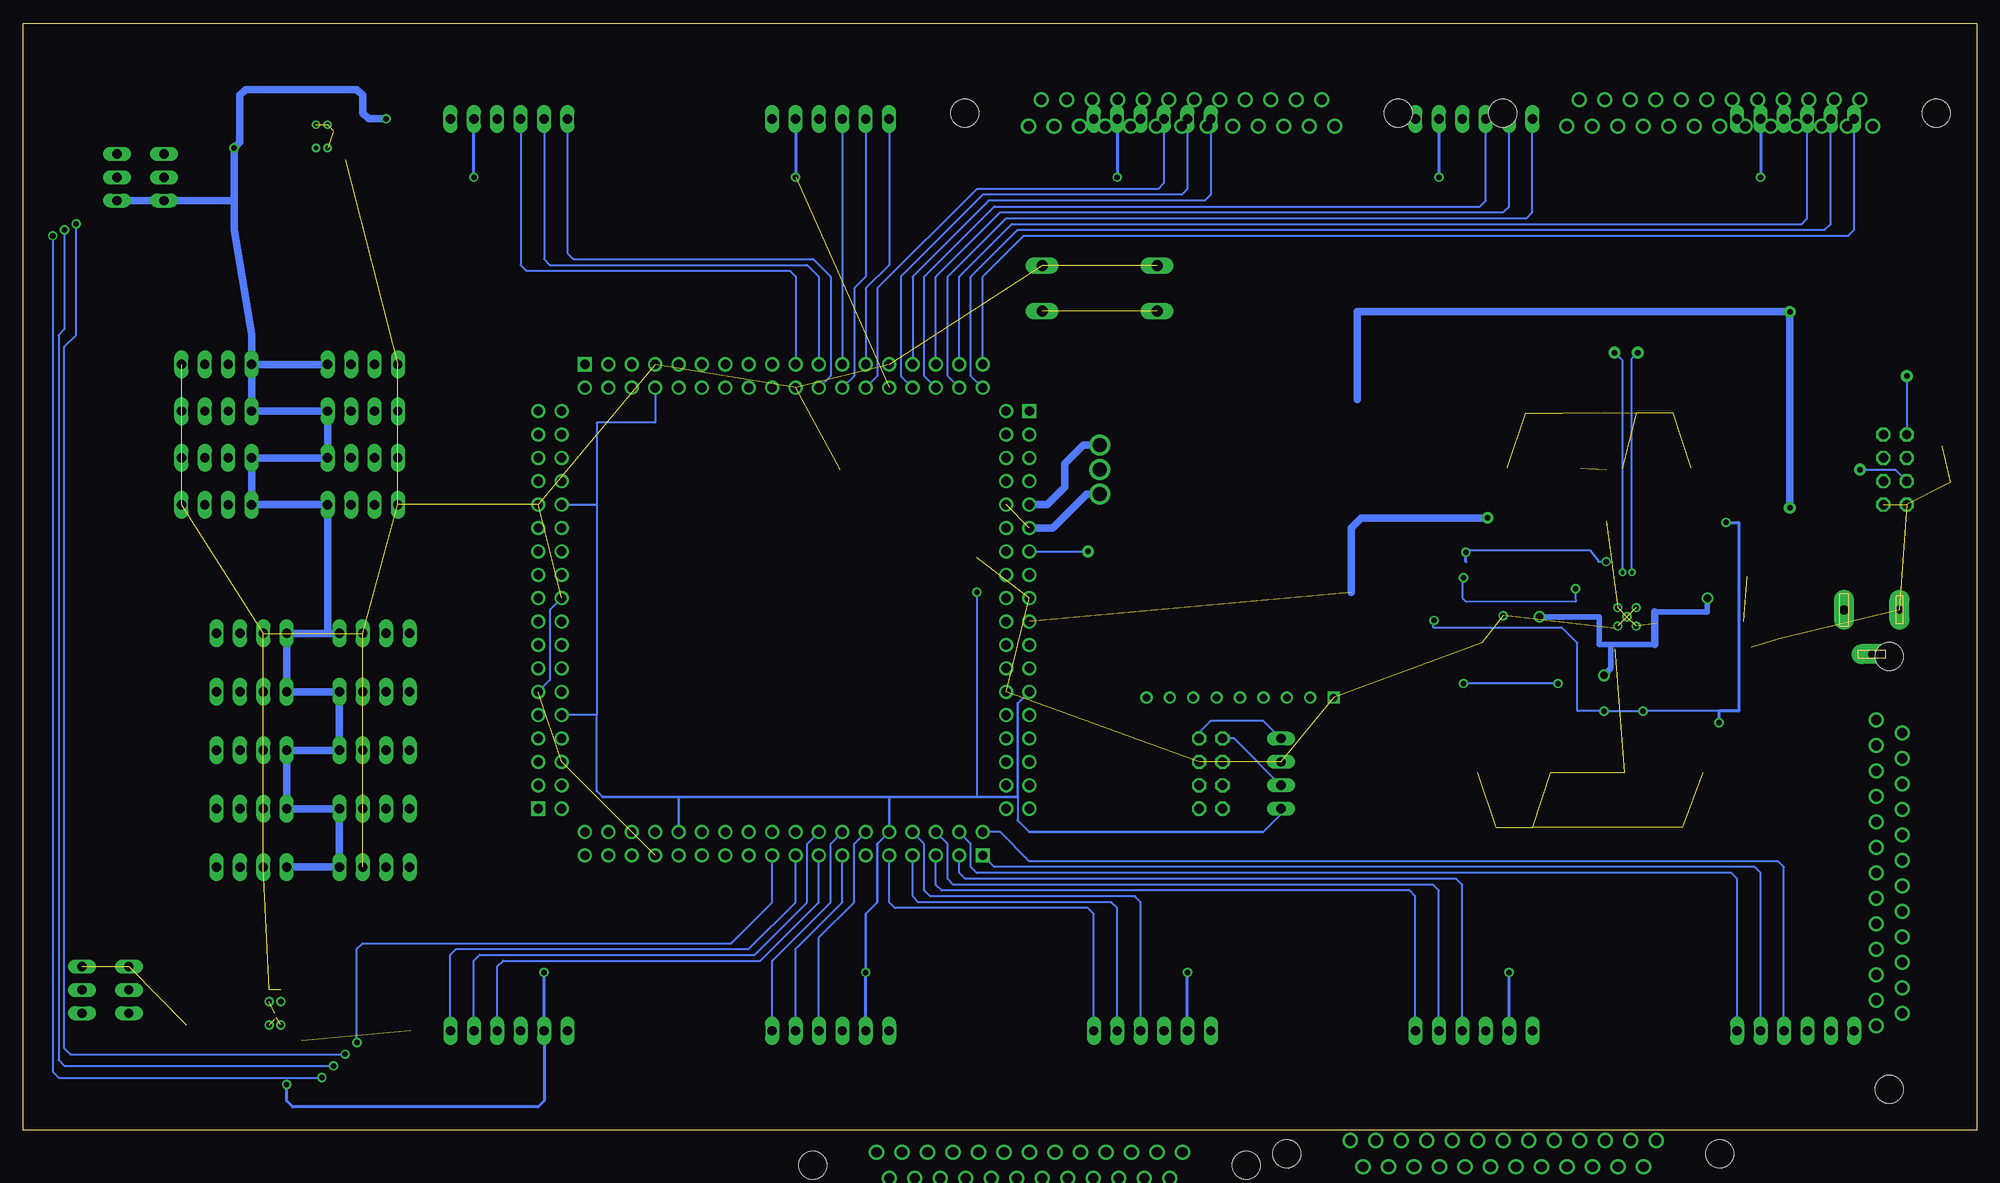
[diagram p3: board, bottom side, seen from below]

Size 212.14 x 120.26 mm. Coordinates in mm from the lower left corner, seen from the top.
Outline: 0,0 212.14,0 212.14,120.26 0,120.26 0,0
Copper layers (1*16): Top 0.035mm / dielectric 1.5mm / Bottom 0.035mm
Design rules "default": minimum track width 10mil, minimum drill 24mil, track to track 8mil, track to pad 8mil, pad to pad 8mil, via to via 8mil, smd to smd 8mil, copper to edge 40mil, drill to drill 8mil, minimum pad ring 10mil, minimum via ring 8mil, stop-mask expansion 4mil, vias tented up to drill 0mil, thermal gap 10mil

### Footprints (pad centres in the part's own frame; a part is rotated, then mirrored left to right if it is on the bottom)
MA18-2 = drill 1.016 square: 1 -21.59,-1.27 | drill 1.016: 2 -21.59,1.27; 3 -19.05,-1.27; 4 -19.05,1.27; 5 -16.51,-1.27; 6 -16.51,1.27; 7 -13.97,-1.27; 8 -13.97,1.27; 9 -11.43,-1.27; 10 -11.43,1.27; 11 -8.89,-1.27; 12 -8.89,1.27; 13 -6.35,-1.27; 14 -6.35,1.27; 15 -3.81,-1.27; 16 -3.81,1.27; 17 -1.27,-1.27; 18 -1.27,1.27; 19 1.27,-1.27; 20 1.27,1.27; 21 3.81,-1.27; 22 3.81,1.27; 23 6.35,-1.27; 24 6.35,1.27; 25 8.89,-1.27; 26 8.89,1.27; 27 11.43,-1.27; 28 11.43,1.27; 29 13.97,-1.27; 30 13.97,1.27; 31 16.51,-1.27; 32 16.51,1.27; 33 19.05,-1.27; 34 19.05,1.27; 35 21.59,-1.27; 36 21.59,1.27
C1206 = smd 1.6 x 1.8: 1 -1.4,0; 2 1.4,0
MA04-1 = drill 1.016 long: 1 -3.81,0; 2 -1.27,0; 3 1.27,0; 4 3.81,0
R1206 = smd 1.6 x 1.803: 1 -1.422,0; 2 1.422,0
SO20W = smd 0.66 x 2.032: 1 -5.715,-5.029; 2 -4.445,-5.029; 3 -3.175,-5.029; 4 -1.905,-5.029; 5 -0.635,-5.029; 6 0.635,-5.029; 7 1.905,-5.029; 8 3.175,-5.029; 9 4.445,-5.029; 10 5.715,-5.029; 11 5.715,5.029; 12 4.445,5.029; 13 3.175,5.029; 14 1.905,5.029; 15 0.635,5.029; 16 -0.635,5.029; 17 -1.905,5.029; 18 -3.175,5.029; 19 -4.445,5.029; 20 -5.715,5.029
SPC4077 = drill 0.8 pad 2.184 long: 1 -3,0; 2 0,-4.8 | drill 1 pad 2.184 long: 3 3,0
1206 = smd 1.6 x 1.803: A -1.422,0; C 1.422,0
RACON12 = drill 1.194 long: 1 -6.248,2.489; 2 6.248,2.489; 3 -6.248,-2.489; 4 6.248,-2.489
SIL9 = drill 0.813 square: 1 -10.16,0 | drill 0.813: 2 -7.62,0; 3 -5.08,0; 4 -2.54,0; 5 0,0; 6 2.54,0; 7 5.08,0; 8 7.62,0; 9 10.16,0
MA04-2 = drill 1.016 octagon: 1 -3.81,-1.27; 2 -3.81,1.27; 3 -1.27,-1.27; 4 -1.27,1.27; 5 1.27,-1.27; 6 1.27,1.27; 7 3.81,-1.27; 8 3.81,1.27
MA06-1 = drill 1.016 long: 1 -6.35,0; 2 -3.81,0; 3 -1.27,0; 4 1.27,0; 5 3.81,0; 6 6.35,0
MA03-1 = drill 1.016 long: 1 -2.54,0; 2 0,0; 3 2.54,0
TL3XPO = drill 1.524 pad 2.032: 1 -2.667,0; 2 0,0; 3 2.667,0
DCK6 = smd 0.85 x 0.35: 1 -1.1,0.65; 2 -1.1,0; 3 -1.1,-0.65; 4 1.1,-0.65; 5 1.1,0; 6 1.1,0.65
VQFN48 = smd 4.2 x 4.2: 0 0,0 | smd 1 x 0.3: 1 -3.5,2.75; 2 -3.5,2.25; 3 -3.5,1.75; 4 -3.5,1.25; 5 -3.5,0.75; 6 -3.5,0.25; 7 -3.5,-0.25; 8 -3.5,-0.75; 9 -3.5,-1.25; 10 -3.5,-1.75; 11 -3.5,-2.25; 12 -3.5,-2.75; 25 3.5,-2.75; 26 3.5,-2.25; 27 3.5,-1.75; 28 3.5,-1.25; 29 3.5,-0.75; 30 3.5,-0.25; 31 3.5,0.25; 32 3.5,0.75; 33 3.5,1.25; 34 3.5,1.75; 35 3.5,2.25; 36 3.5,2.75 | smd 0.3 x 1: 13 -2.75,-3.5; 14 -2.25,-3.5; 15 -1.75,-3.5; 16 -1.25,-3.5; 17 -0.75,-3.5; 18 -0.25,-3.5; 19 0.25,-3.5; 20 0.75,-3.5; 21 1.25,-3.5; 22 1.75,-3.5; 23 2.25,-3.5; 24 2.75,-3.5; 37 2.75,3.5; 38 2.25,3.5; 39 1.75,3.5; 40 1.25,3.5; 41 0.75,3.5; 42 0.25,3.5; 43 -0.25,3.5; 44 -0.75,3.5; 45 -1.25,3.5; 46 -1.75,3.5; 47 -2.25,3.5; 48 -2.75,3.5
DBT_R-PDSO-G30 = smd 0.3 x 1.2: 1 -4.5,-2.9; 2 -4,-2.9; 3 -3.5,-2.9; 4 -3,-2.9; 5 -2.5,-2.9; 6 -2,-2.9; 7 -1.5,-2.9; 8 -1,-2.9; 9 -0.5,-2.9; 10 0,-2.9; 11 0.5,-2.9; 12 1,-2.9; 13 1.5,-2.9; 14 2,-2.9; 15 2.5,-2.9; 16 2.5,2.9; 17 2,2.9; 18 1.5,2.9; 19 1,2.9; 20 0.5,2.9; 21 0,2.9; 22 -0.5,2.9; 23 -1,2.9; 24 -1.5,2.9; 25 -2,2.9; 26 -2.5,2.9; 27 -3,2.9; 28 -3.5,2.9; 29 -4,2.9; 30 -4.5,2.9
DRL5 = smd 0.5 x 0.25: 1 -0.9,0.5; 2 -0.9,0; 3 -0.9,-0.5; 4 0.9,-0.5; 6 0.9,0.5
H3M25RA = drill 1.092: 1 -16.612,1.422; 2 -13.843,1.422; 3 -11.074,1.422; 4 -8.306,1.422; 5 -5.537,1.422; 6 -2.769,1.422; 7 0,1.422; 8 2.769,1.422; 9 5.537,1.422; 10 8.306,1.422; 11 11.074,1.422; 12 13.843,1.422; 13 16.612,1.422; 14 -15.227,-1.422; 15 -12.459,-1.422; 16 -9.69,-1.422; 17 -6.921,-1.422; 18 -4.153,-1.422; 19 -1.384,-1.422; 20 1.384,-1.422; 21 4.153,-1.422; 22 6.921,-1.422; 23 9.69,-1.422; 24 12.459,-1.422; 25 15.227,-1.422 | hole 3.048: -23.52,0; 23.52,0

### Placement (x,y rotation side)
1_TO_36  104.14,56.52 270 top
37_TO_72  129.54,31.11 0 top
73_TO_108  154.94,56.52 90 top
144_TO_109  129.54,81.92 180 top
ADC1_C1  171.45,113.03 180 top
ADC1_C2  171.45,109.86 180 top
ADC1_C3  190.5,106.68 0 top
ADC1_C4  179.71,115.57 180 top
ADC2_C1  193.04,7.62 0 top
ADC2_C2  193.04,11.43 0 top
ADC2_C3  171.45,10.79 180 top
ADC2_C4  184.78,5.08 0 top
C3  31,61.52 90 top
C4  30.5,51.02 270 top
C5  25,61.52 270 top
C8  24.5,51.02 90 top
C9  21.5,54.77 270 top
C10  47.75,51.52 270 top
C25  105.41,91.44 90 top
C27  53.75,51.52 90 top
C28  25.25,39.13 0 top
C31  36,34.27 90 top
C32  32,34.27 90 top
C33  38.25,40.27 90 top
C34  40.25,34.27 90 top
C35  42.25,40.27 90 top
C36  44.25,34.27 90 top
C37  46.25,40.27 90 top
C38  48.25,34.27 90 top
C39  52.25,34.27 90 top
C40  52.25,47.02 180 top
C41  26.5,69.02 0 top
C42  33,76.52 90 top
C43  37,76.52 90 top
C44  38.5,70.52 90 top
C45  43,70.52 90 top
C46  45,76.52 90 top
C47  49,76.52 90 top
C48  51.75,66.52 0 top
C49  46.75,60.02 90 top
C50  52.75,60.02 90 top
ENC_0  187.32,28.57 0 top
ENC_1  187.32,34.92 0 top
ENC_2  187.32,41.27 0 top
ENC_3  187.32,47.62 0 top
ENC_4  187.32,53.98 0 top
ENC_5  173.99,28.57 180 top
ENC_6  173.99,34.92 180 top
ENC_7  173.99,41.27 180 top
ENC_8  173.99,47.62 180 top
ENC_9  173.99,53.98 180 top
ENC_PR_0_A  197.49,25.4 180 top
ENC_PR_0_B  197.49,28.57 180 top
ENC_PR_1_A  197.49,31.75 180 top
ENC_PR_1_B  197.49,34.92 180 top
ENC_PR_2_A  197.49,38.1 180 top
ENC_PR_2_B  197.49,41.27 180 top
ENC_PR_3_A  197.49,44.45 180 top
ENC_PR_3_B  197.49,47.62 180 top
ENC_PR_4_A  197.49,50.8 180 top
ENC_PR_4_B  197.49,53.98 180 top
ENC_PR_5_A  163.83,25.4 0 top
ENC_PR_5_B  163.83,28.57 0 top
ENC_PR_6_A  163.83,31.75 0 top
ENC_PR_6_B  163.83,34.92 0 top
ENC_PR_7_A  163.83,38.1 0 top
ENC_PR_7_B  163.83,41.27 0 top
ENC_PR_8_A  163.83,44.45 0 top
ENC_PR_8_B  163.83,47.62 0 top
ENC_PR_9_A  163.83,50.8 0 top
ENC_PR_9_B  163.83,53.98 0 top
IC1  116.2,66.04 90 top
J3  11.43,56.52 0 top
L1  28,61.52 270 top
L2  27.5,51.02 90 top
L3  50.75,51.52 90 top
L4  49.75,60.02 270 top
LED_0  72.39,52.7 90 top
LED_1  74.93,52.7 90 top
LED_2  77.47,52.7 90 top
LED_3  80.01,52.7 90 top
LED_4  82.55,52.7 90 top
LED_5  85.09,52.7 90 top
LED_6  87.63,52.7 90 top
LED_7  90.17,52.7 90 top
R1  114.94,76.83 0 top
R3  3.81,87 90 top
R4  7.62,87 90 top
R11  29.5,46.52 0 top
R12  25.25,41.77 180 top
R13  95.25,62.87 0 top
R18  29.75,40.27 90 top
R19  34,40.27 90 top
R20  36.25,47.02 90 top
R21  50.25,40.27 90 top
R22  54.25,40.27 90 top
R23  52.25,45.02 180 top
R24  28.75,66.02 180 top
R25  26.5,71.65 180 top
R26  31,70.52 90 top
R27  35,70.52 90 top
R28  57.25,62.52 0 top
R29  41,76.52 90 top
R30  47,70.52 90 top
R31  51,70.52 90 top
R32  51.75,64.52 180 top
R33  57.25,60.02 180 top
R34  39.5,65.02 90 top
R35  57.25,55.52 180 top
RST  95.25,91.44 180 top
SIL9  80.01,46.99 0 top
SV1  8.89,71.75 270 top
SV2  83.19,38.73 270 top
SV3  75.56,38.73 270 top
SV4  19.68,10.79 180 top
SV5  54.61,10.79 180 top
SV6  89.53,10.79 180 top
SV7  124.46,10.79 180 top
SV8  159.38,10.79 180 top
SV9  159.38,109.86 0 top
SV10  124.46,109.86 0 top
SV11  89.53,109.86 0 top
SV12  54.61,109.86 0 top
SV13  19.68,109.86 0 top
SV14  196.85,103.5 90 top
SV15  201.93,103.5 90 top
SV16  205.74,15.24 90 top
SV17  200.66,15.24 90 top
SW_0  95.25,71.75 270 top
U$1  3.81,74.3 270 top
U$2  38,55.77 0 top
U$3  179.71,107.95 270 top
U$4  124.46,71.12 180 top
U$5  3.81,69.85 180 top
U$6  184.78,12.7 90 top
US_0  175.26,83.19 180 top
US_1  175.26,78.11 180 top
US_2  175.26,73.03 180 top
US_3  175.26,67.94 180 top
US_4  191.13,83.19 0 top
US_5  191.13,78.11 0 top
US_6  191.13,73.03 0 top
US_7  191.13,67.94 0 top
US_PR_0  165.1,85.72 0 top
US_PR_1  165.1,80.64 0 top
US_PR_2  165.1,75.56 0 top
US_PR_3  165.1,70.48 0 top
US_PR_4  201.29,85.72 180 top
US_PR_5  201.29,80.64 180 top
US_PR_6  201.29,75.56 180 top
US_PR_7  201.29,70.48 180 top
X1  9.53,27.94 270 top
X2  51.44,-2.54 0 top
X3  102.87,-3.81 0 top
X4  27.94,110.49 180 top
X5  86.36,110.49 180 top

### Tracks (layer width: path | path; a pad name or v marks a point on that pad's centre or on a via)
0_A
  Top 0.203: 188.59,27.3 ENC_0.3 188.59,26.67 189.87,25.4 ENC_PR_0_A.2
0_B
  Top 0.203: ENC_0.4 ENC_PR_0_B.2
1_A
  Top 0.203: ENC_PR_1_A.2 189.87,31.75 188.59,33.02 ENC_1.3
1_B
  Top 0.203: ENC_PR_1_B.2 ENC_1.4
2_A
  Top 0.203: ENC_PR_2_A.2 189.87,38.1 188.59,39.37 ENC_2.3
2_B
  Top 0.203: ENC_PR_2_B.2 ENC_2.4
3_A
  Top 0.203: ENC_PR_3_A.2 189.87,44.45 188.59,45.72 ENC_3.3
3_B
  Top 0.203: ENC_PR_3_B.2 ENC_3.4
4_A
  Top 0.203: ENC_PR_4_A.2 189.87,50.8 188.59,52.07 ENC_4.3
4_B
  Top 0.203: ENC_PR_4_B.2 ENC_4.4
5_A
  Top 0.203: ENC_PR_5_A.2 171.45,25.4 172.72,26.67 ENC_5.3
5_B
  Top 0.203: ENC_5.4 ENC_PR_5_B.2
6_A
  Top 0.203: ENC_PR_6_A.2 171.45,31.75 172.72,33.02 ENC_6.3
6_B
  Top 0.203: ENC_6.4 ENC_PR_6_B.2
7_A
  Top 0.203: ENC_PR_7_A.2 171.45,38.1 172.72,39.37 ENC_7.3
7_B
  Top 0.203: ENC_PR_7_B.2 ENC_7.4
8_A
  Top 0.203: ENC_PR_8_A.2 171.45,44.45 172.72,45.72 ENC_8.3
8_B
  Top 0.203: ENC_8.4 ENC_PR_8_B.2
9_A
  Top 0.203: ENC_PR_9_A.2 171.45,50.8 172.72,52.07 ENC_9.3
9_B
  Top 0.203: ENC_PR_9_B.2 ENC_9.4
BTN
  Top 0.203: 123.42,70.48 U$4.6
BTN_0
  Top 0.203: IC1.12 1_TO_36.8
BTN_1
  Top 0.203: IC1.11 104.14,71.75 1_TO_36.7
CS_0
  Top 0.203: SV9.4 160.66,107.95 161.16,107.45 U$3.11
CS_1
  Top 0.203: SV13.4 20.95,105.41 21.59,104.78 184.15,104.78 184.15,105.95 U$3.17
CS_2
  Top 0.203: SV4.4 18.41,15.24 19.05,15.88 189.23,15.88 189.23,14.7 U$6.14
CS_3
  Top 0.203: SV8.4 158.12,12.7 158.62,13.2 U$6.20
CS_4
  Top 0.203: SV10.4 125.73,107.31 126.36,106.68 165.74,106.68 166,106.95 U$3.12
CS_5
  Top 0.203: SV11.4 90.81,106.68 91.44,106.05 166.37,106.05 166.78,106.45 U$3.13
CS_6
  Top 0.203: SV12.4 55.88,106.05 56.52,105.41 167,105.41 167.54,105.95 U$3.14
CS_7
  Top 0.203: SV5.4 53.34,14.61 53.98,15.24 166.37,15.24 166.91,14.7 U$6.17
CS_8
  Top 0.203: SV6.4 88.27,13.97 88.9,14.61 165.74,14.61 166.14,14.2 U$6.18
CS_9
  Top 0.203: SV7.4 123.19,13.34 123.83,13.97 165.1,13.97 165.37,13.7 U$6.19
E_0
  Top 0.203: US_PR_0.2 173.35,85.72 173.99,85.09 US_0.3
E_1
  Top 0.203: US_1.3 173.99,80.01 173.35,80.64 US_PR_1.2
E_2
  Top 0.203: US_2.3 173.99,74.93 173.35,75.56 US_PR_2.2
E_3
  Top 0.203: US_3.3 173.99,69.85 173.35,70.48 US_PR_3.2
E_4
  Top 0.203: US_4.3 192.41,85.09 193.04,85.72 US_PR_4.2
E_5
  Top 0.203: US_5.3 192.41,80.01 193.04,80.64 US_PR_5.2
E_6
  Top 0.203: US_6.3 192.41,74.93 193.04,75.56 US_PR_6.2
E_7
  Top 0.203: US_7.3 192.41,69.85 193.04,70.48 US_PR_7.2
EN_0
  Bottom 0.203: SV9.2 155.57,94.61 154.94,93.98 127,93.98 125.73,92.71 144_TO_109.21
EN_1
  Bottom 0.203: 144_TO_109.36 109.22,81.92 109.22,92.71 104.14,97.79 16.51,97.79 15.88,98.42 SV13.2
EN_2
  Bottom 0.203: SV4.2 23.5,27.94 24.13,28.57 106.68,28.57 37_TO_72.1
EN_3
  Bottom 0.203: SV8.2 163.19,18.41 162.56,19.05 132.72,19.05 127,24.77 127,31.11 37_TO_72.16
EN_4
  Bottom 0.203: SV10.2 120.65,92.71 121.92,91.44 121.92,81.92 144_TO_109.24
EN_5
  Bottom 0.203: SV11.2 85.72,102.23 86.36,101.6 107.95,101.6 116.84,92.71 116.84,81.92 144_TO_109.30
EN_6
  Bottom 0.203: 144_TO_109.31 113.03,92.71 106.05,99.69 51.44,99.69 50.8,100.33 SV12.2
EN_7
  Bottom 0.203: SV5.2 58.42,26.04 59.05,26.67 111.12,26.67 111.76,27.3 111.76,31.11 37_TO_72.6
EN_8
  Bottom 0.203: SV6.2 93.34,24.13 93.98,24.77 114.94,24.77 115.57,25.4 37_TO_72.7
EN_9
  Bottom 0.203: SV7.2 128.27,19.68 123.19,24.77 37_TO_72.13
ENC_0_A
  Top 0.203: ENC_PR_0_A.1 205.74,25.4 206.38,26.04 206.38,62.23 205.74,62.87 160.66,62.87 158.12,65.41 73_TO_108.25
ENC_0_B
  Top 0.203: ENC_PR_0_B.1 199.54,27.94 205.1,27.94 205.74,28.57 205.74,61.59 205.1,62.23 160.02,62.23 158.12,64.14 154.94,64.14 73_TO_108.26
ENC_1_A
  Top 0.203: ENC_PR_1_A.1 199.54,31.11 204.47,31.11 205.1,31.75 205.1,60.96 204.47,61.59 159.38,61.59 158.12,62.87 73_TO_108.23
ENC_1_B
  Top 0.203: ENC_PR_1_B.1 203.84,34.92 204.47,35.56 204.47,60.33 203.84,60.96 158.75,60.96 158.12,61.59 154.94,61.59 73_TO_108.24
ENC_2_A
  Top 0.203: ENC_PR_2_A.1 203.2,38.1 203.84,38.73 203.84,59.69 203.2,60.33 73_TO_108.21
ENC_2_B
  Top 0.203: ENC_PR_2_B.1 202.56,41.27 203.2,41.91 203.2,59.05 202.56,59.69 158.75,59.69 158.12,59.05 154.94,59.05 73_TO_108.22
ENC_3_A
  Top 0.203: ENC_PR_3_A.1 201.93,44.45 202.56,45.09 202.56,58.42 201.93,59.05 159.38,59.05 158.12,57.78 73_TO_108.19
ENC_3_B
  Top 0.203: ENC_PR_3_B.1 201.29,47.62 201.93,48.26 201.93,57.78 201.29,58.42 160.02,58.42 158.12,56.52 158.12,54.61 157.48,53.98 154.94,53.98 73_TO_108.16
ENC_4_A
  Top 0.203: ENC_PR_4_A.1 200.66,50.8 201.29,51.44 201.29,57.15 200.66,57.78 160.66,57.78 158.75,55.88 158.75,53.34 158.12,52.7 73_TO_108.15
ENC_4_B
  Top 0.203: ENC_PR_4_B.1 198.75,54.13 198.75,56.52 198.12,57.15 161.29,57.15 159.38,55.24 159.38,52.07 158.75,51.44 154.94,51.44 73_TO_108.14
ENC_5_A
  Top 0.203: ENC_PR_5_A.1 153.67,34.14 73_TO_108.2
ENC_5_B
  Top 0.203: ENC_PR_5_B.1 161.77,29.21 160.02,29.21 156.21,33.02 73_TO_108.1
ENC_6_A
  Top 0.203: 73_TO_108.3 158.12,37.47 158.75,36.83 158.75,32.38 159.38,31.75 ENC_PR_6_A.1
ENC_6_B
  Top 0.203: ENC_PR_6_B.1 161.77,35.56 160.66,35.56 160.02,36.2 160.02,37.47 158.75,38.73 154.94,38.73 73_TO_108.4
ENC_7_A
  Top 0.203: ENC_PR_7_A.1 161.77,38.73 160.66,38.73 159.38,40.01 73_TO_108.5
ENC_7_B
  Top 0.203: ENC_PR_7_B.1 160.66,41.27 159.38,42.55 73_TO_108.7
ENC_8_A
  Top 0.203: ENC_PR_8_A.1 161.77,43.81 154.94,43.81 73_TO_108.8
ENC_8_B
  Top 0.203: ENC_PR_8_B.1 160.66,47.62 158.12,45.09 73_TO_108.9
ENC_9_A
  Top 0.203: ENC_PR_9_A.1 161.14,49.53 160.02,49.53 159.38,48.9 154.94,48.9 73_TO_108.12
ENC_9_B
  Top 0.203: 73_TO_108.13 159.38,50.16 160.02,50.8 160.02,53.34 160.66,53.98 ENC_PR_9_B.1
ENSW3  (via drill 0.6 pad 1)
  Top 0.203: U$2.27 44.75,54.02 44.75,48.52 v45.5,48.52 | v55.75,48.52 55.75,55.44
  Top 0.3: 55.75,55.44 R35.2
  Bottom 0.203: v45.5,48.52 v55.75,48.52
ENSW4  (via drill 0.6 pad 1)
  Top 0.203: U$2.34 43.6,57.52 v43.6,58.82
  Top 0.3: v55.75,60.02 R33.2
  Bottom 0.203: v43.6,58.82 43.6,58 43.59,57.38 55.5,57.4 55.83,57.73 R33.2 v55.75,60.02 55.88,59.88
  Bottom 0.3: 55.75,59.97 v55.75,60.02
GND  (via drill 0.5, 0.6, 0.6 pad 1)  (81 unrouted)
  Top 0.203: 40.25,66.19 40.25,71.77 39,71.77 | U$1.2 3.81,74.3 1.91,74.3 | 1_TO_36.10 107.31,67.94 108.58,66.67 108.58,62.23 109.22,61.59 IC1.19 115.16,61.59 115.16,71.75 IC1.10 123.42,71.75 U$4.4 | ADC1_C1.2 169.54,112.9 169.54,114.3 170.18,114.94 173.99,114.94 174.62,114.3 174.62,112.39 175.57,111.45 U$3.3 178.44,111.45 | ADC1_C2.2 170.18,109.72 170.18,108.58 170.81,107.95 U$3.10 U$3.9 178.3,108.45 178.44,108.58 | 178.44,108.58 178.44,109.95 | 178.44,109.95 U$3.6 | 178.44,109.95 178.44,110.95 | 178.44,110.95 178.44,111.45 | ADC1_C4.2 178.31,111.58 178.44,111.45 | U$3.27 178.44,110.95 | 178.44,108.58 178.44,108.45 U$3.22 193.18,108.45 193.68,107.95 193.68,106.68 ADC1_C3.2 | U$6.22 184.65,12.2 184.78,12.06 | 184.78,12.06 184.78,10.7 | 184.78,9.7 U$6.27 | 185.42,9.2 U$6.3 189.87,9.2 189.87,5.71 190.5,5.08 193.68,5.08 194.44,5.84 ADC2_C1.2 ADC2_C2.2 | 185.42,9.2 184.78,9.2 184.78,9.7 | ADC2_C4.2 185.42,5.08 185.42,9.2 | U$6.6 184.78,10.7 | 184.78,10.7 184.78,9.7 | 184.78,12.06 184.78,12.7 U$6.10 U$6.9 | 182.25,15.24 184.15,15.24 v184.15,13.97 | 187.32,15.24 185.42,15.24 v185.42,13.97 | 177.16,105.41 179.07,105.41 v179.07,106.68 v180.34,106.68 180.34,105.41 182.25,105.41
  Top 0.254: 37_TO_72.11 121.92,31.11 127,31.11 37_TO_72.18 129.54,31.11 142.24,31.11 37_TO_72.29
  Top 0.3: U$2.7 U$2.8 | U$2.7 34.25,55.52 34.25,55.27 34.25,55.02 | 34.5,55.27 U$2.7 | R34.2 40.25,66.19 | 39,71.77 C44.2 | 39.25,54.52 v39,54.77 | U$2.7 34.75,55.52 34.75,55.02
  Top 0.305: U$2.21 39.25,54.52
  Top 0.406: SV14.3 192.53,106.05 ADC1_C3.2
  Top 0.61: 34.25,55.27 25.4,55.24 25.4,53.31 C8.2
  Top 0.8: 24.77,60.33 C5.2
  Top 0.813: SV15.3 SV14.3
  Bottom 0.203: 73_TO_108.20 154.94,56.52 154.94,48.9 73_TO_108.11
  Bottom 0.813: 1_TO_36.11 100.33,65.41 96.65,69.09 SW_0.3
  other vias: 38,55.77 37,56.77 37,54.77 39,56.77 185.42,11.43 184.15,11.43 179.07,109.22 180.34,109.22 51.44,55.88
LED_0
  Top 0.203: LED_0.C 72.39,55.24 77.47,60.33 91.44,60.33 99.06,52.7 1_TO_36.21
LED_1
  Top 0.203: LED_1.C 74.93,55.24 79.38,59.69 91.44,59.69 99.69,51.44 104.14,51.44 1_TO_36.22
LED_2
  Top 0.203: LED_2.C 77.47,55.24 81.28,59.05 91.44,59.05 100.33,50.16 1_TO_36.23
LED_3
  Top 0.203: LED_3.C 80.01,55.24 83.19,58.42 91.44,58.42 100.97,48.9 104.14,48.9 1_TO_36.24
LED_4
  Top 0.203: LED_4.C 82.55,55.24 85.09,57.78 91.44,57.78 93.98,55.24 93.98,46.99 95.89,45.09 1_TO_36.27
LED_5
  Top 0.203: LED_5.C 85.09,55.24 87,57.15 91.44,57.15 93.34,55.24 93.34,46.35 95.89,43.81 104.14,43.81 1_TO_36.28
LED_6
  Top 0.203: LED_6.C 87.63,55.24 88.9,56.52 91.44,56.52 92.71,55.24 92.71,45.72 95.89,42.55 1_TO_36.29
LED_7
  Top 0.203: LED_7.C 90.17,55.24 90.81,55.88 91.44,55.88 92.08,55.24 92.08,45.09 95.89,41.27 104.14,41.27 1_TO_36.30
MISO_H  (via drill 0.6)
  Top 0.203: U$3.26 190.5,110.45 190.5,110.49 207.65,110.49 208.91,109.22 v208.91,97.16 207.65,95.89 189.23,95.89 188.59,96.52 188.59,100.33 187.96,100.97 166.37,100.97 165.74,100.33 154.31,100.33 139.7,85.72 139.7,81.92 144_TO_109.12 | v179.71,5.71 179.71,10.2 U$6.26
  Bottom 0.203: v208.91,97.16 208.91,6.35 208.28,5.71 v179.71,5.71
MISO_S  (via drill 0.6 pad 1.27)
  Top 0.203: U$5.3 7.49,70.35 SV1.5 | 1_TO_36.6 104.14,74.3 100.33,74.3 98.42,76.2 98.42,78.11 97.79,78.74 72.39,78.74 69.85,81.28 17.78,81.28 15.24,78.74 15.24,74.3 v12.7,71.75
  Bottom 0.203: v12.7,71.75 8.89,71.75 SV1.5
MOSI_H  (via drill 0.6)
  Top 0.203: U$3.25 206.38,109.95 207.65,108.68 v207.65,97.79 206.38,96.52 189.87,96.52 189.23,97.16 189.23,100.97 188.59,101.6 165.74,101.6 165.1,100.97 153.67,100.97 138.43,85.72 144_TO_109.11 | v178.44,6.99 178.44,10.7 U$6.25
  Bottom 0.203: v207.65,97.79 207.65,87 208.28,86.36 208.28,7.62 207.65,6.99 v178.44,6.99
MOSI_S
  Top 0.203: 1_TO_36.5 100.33,73.03 97.79,75.56 97.79,77.47 97.16,78.11 71.75,78.11 69.22,80.64 18.41,80.64 16.51,78.74 16.51,73.66 13.34,70.48 SV1.6 8.89,69.22 6.35,69.22 5.08,67.94 3.81,67.94 2.91,68.84 U$5.6
MXO_0
  Top 0.203: U$3.8 U$3.7
MXO_1
  Top 0.203: U$6.8 U$6.7
N$3
  Top 1.143: C4.1 30.5,54.02 U$2.10
  Top 1.3: L2.2 C4.1
N$10
  Top 0.203: U$2.1 32.75,58.52 32.75,62.77 31,62.77
  Top 0.3: 31,62.77 C3.2
N$11
  Top 1.143: U$2.3 31,57.52 C3.1
  Top 1.3: C3.1 L1.2
N$12
  Top 0.203: U$2.12 32.25,53.02 32.25,49.77 31,49.77
  Top 0.3: 31,49.77 C4.2
N$13
  Top 0.3: 46,53.02 47.25,53.02 C10.1
  Top 0.305: U$2.29 46,55.02 46,53.02
  Top 0.8: C10.1 L3.2
N$14
  Top 0.203: U$2.28 45.5,54.52 45.5,50.27 47.25,50.27
  Top 0.3: 47.25,50.27 C10.2
N$16
  Top 0.203: U$2.13 35.25,51.77 32.75,51.77 32.75,46.52 R11.2
N$17
  Top 0.203: U$2.14 35.75,51.27 33.25,51.27 33.25,44.44 29.75,44.44 R18.2 | R12.1 30.25,41.77
  Top 0.3: C28.2 26.67,41.52 R12.1 | 30.25,41.77 R18.2
N$18
  Top 0.203: 34,43.69 32,43.69 C32.2 | 34,43.69 34,50.77 36.25,50.77 U$2.15 | 34,43.69 R19.2
N$19
  Top 0.203: LED_0.A SIL9.2
N$21
  Top 0.203: SIL9.6 LED_4.A
N$22
  Top 0.203: SIL9.8 LED_6.A
N$23
  Top 0.203: LED_1.A SIL9.3
N$24
  Top 0.203: SIL9.5 LED_3.A
N$25
  Top 0.203: SIL9.7 LED_5.A
N$26
  Top 0.203: LED_7.A SIL9.9
N$27
  Top 0.203: R19.1 36,38.84 C31.2
N$28
  Top 0.203: R13.1 93.83,65.25 95.25,66.67 97.16,66.67 97.79,67.31 97.79,70.48 96.52,71.75 SW_0.2
N$29
  Top 0.203: U$2.17 37.25,49.27 36.25,49.27 R20.2
  Top 0.3: 36.25,48.27 R20.2
N$35
  Top 0.203: U$2.18 37.75,43.27 40.25,43.27 C34.2
N$36
  Top 0.203: U$2.19 38.25,43.77 42.25,43.77 C35.2
N$37
  Top 0.203: R21.1 50.25,35.52 52.25,35.52
  Top 0.3: 52.25,35.52 C39.2
N$38
  Top 0.203: U$2.26 44,53.52 44,47.27 50.75,47.27 | 50.75,43.27 50.83,43.27 | R22.2 54.25,43.27 50.83,43.27 | 50.83,43.27 R23.2
  Top 0.8: 50.75,47.27 50.75,47.02 C40.2 50.85,45.02 R23.2
N$39
  Top 0.203: C38.2 48.25,41.77 | 48.25,41.77 50.25,41.77 | U$2.25 43,53.02 43,46.02 48.25,46.02 48.25,41.77
  Top 0.3: 50.25,41.77 R21.2
N$40
  Top 0.203: U$2.48 35.25,59.77 33.5,59.77 33.5,66.02 R24.1
N$41
  Top 0.203: U$2.24 40.75,51.02 42,51.02 42,44.77 46.25,44.77 C37.2
N$44
  Top 0.203: U$2.16 36.75,50.27 34.75,50.27 34.75,43.77 36.25,43.77 36.25,41.77 38.25,41.77
  Top 0.3: 38.25,41.52 C33.2 38.25,41.77
N$47
  Top 0.203: R27.2 35,75.27 33,75.27
  Top 0.3: 33,75.27 C42.1
N$54
  Top 0.203: 41.25,75.09 41.25,60.77 40.25,60.77 U$2.38
  Top 0.3: R29.1 41.25,75.09
N$55
  Top 0.203: U$2.35 42.75,58.02 42.75,63.77 49.83,63.77 | R31.1 50.42,69.09 50.42,66.76 | C48.1 50.32,66.55 50,66.55
  Top 0.3: 49.83,63.77 R32.2
  Top 0.8: 50,66.77 50,66.55 50,64.84 R32.2
  Top 0.813: 50.42,66.76 50,66.77
N$57
  Top 0.3: U$2.32 45,56.52 45,58.52 46.75,58.52 C49.1
  Top 0.8: C49.1 L4.2
N$58
  Top 0.203: U$2.47 35.75,60.27 34,60.27 34,66.52 33,66.52 33,69.02 31,69.02
  Top 0.3: 31,69.02 R26.1
  Top 0.8: R26.1 27.9,69.09 C41.2 27.92,69.02 R25.1
N$59
  Top 0.203: U$2.37 40.75,60.27 41.75,60.27 41.75,64.77 43,64.77 C45.1
N$60
  Top 0.203: C46.1 45,69.02 | 45,69.02 47,69.02 | U$2.36 42.25,58.52 42.25,64.27 45,64.27 45,69.02
  Top 0.3: 47,69.02 R30.1
N$61
  Top 0.203: R30.2 47,75.02 49,75.02
  Top 0.3: 49,75.02 C47.1
N$62
  Top 0.203: 36.75,75.11 36.75,69.52 35,69.52 | U$2.46 36.25,60.77 35,60.77 R27.1
  Top 0.3: C43.1 36.75,75.11 | 35,69.52 R27.1
N$63
  Top 0.203: U$2.45 36.75,68.61 39,68.61
  Top 0.3: C44.1 39,68.61 39,68.52
N$65
  Top 0.203: U$2.33 44.5,57.02 44.5,61.52 47.25,61.52
  Top 0.3: 47.25,61.52 C49.2
N$66
  Top 0.203: U$2.40 39.25,63.09
  Top 0.3: 39.25,63.09 R34.1
POT_0
  Top 0.203: U$3.20 185.28,107.45 186.06,106.68 186.06,104.78 186.69,104.14 193.68,104.14 194.31,103.5 SV14.2
POT_1
  Top 0.203: U$3.19 184.51,106.95 185.42,106.05 185.42,104.14 186.06,103.5 193.04,103.5 194.31,102.23 199.39,102.23 200.66,103.5 SV15.2
POT_2
  Top 0.203: U$6.11 190.37,13.2 191.13,13.97 202.56,13.97 203.84,15.24 SV16.2
POT_3
  Top 0.203: U$6.12 189.59,13.7 191.13,15.24 SV17.2
PWM_F_0
  Bottom 0.203: SV9.1 153.03,95.25 152.4,94.61 126.36,94.61 124.46,92.71 124.46,81.92 144_TO_109.22
PWM_F_1
  Bottom 0.203: 144_TO_109.35 107.95,92.71 103.5,97.16 13.97,97.16 13.34,97.79 SV13.1
PWM_F_2
  Bottom 0.203: SV4.1 26.04,27.3 26.67,27.94 108.58,27.94 109.22,28.57 109.22,31.11 37_TO_72.4
PWM_F_3
  Bottom 0.203: SV8.1 165.74,19.05 165.1,19.68 133.35,19.68 128.27,24.77 37_TO_72.17
PWM_F_4
  Bottom 0.203: SV10.1 118.11,93.98 120.65,91.44 144_TO_109.25
PWM_F_5
  Bottom 0.203: SV11.1 83.19,101.6 83.82,100.97 107.31,100.97 115.57,92.71 144_TO_109.29
PWM_F_6
  Bottom 0.203: 144_TO_109.34 111.76,81.92 111.76,92.71 105.41,99.06 48.9,99.06 48.26,99.69 SV12.1
PWM_F_7
  Bottom 0.203: SV5.1 60.96,25.4 61.59,26.04 112.39,26.04 113.03,26.67 37_TO_72.5
PWM_F_8
  Bottom 0.203: SV6.1 95.89,23.5 96.52,24.13 117.47,24.13 118.11,24.77 37_TO_72.9
PWM_F_9
  Bottom 0.203: SV7.1 130.81,18.41 124.46,24.77 124.46,31.11 37_TO_72.14
PWM_R_0
  Bottom 0.203: SV9.3 158.12,93.98 157.48,93.34 128.91,93.34 128.27,92.71 144_TO_109.19
PWM_R_1
  Bottom 0.203: 144_TO_109.33 110.49,92.71 104.78,98.42 19.05,98.42 18.41,99.06 SV13.3
PWM_R_2
  Bottom 0.203: SV4.3 20.95,28.57 21.59,29.21 102.87,29.21 106.05,32.38 37_TO_72.2
PWM_R_3
  Bottom 0.203: SV8.3 160.66,17.78 160.02,18.41 132.08,18.41 125.73,24.77 37_TO_72.15
PWM_R_4
  Bottom 0.203: SV10.3 144_TO_109.23
PWM_R_5
  Bottom 0.203: SV11.3 88.27,102.87 88.9,102.23 108.58,102.23 119.38,91.44 119.38,81.92 144_TO_109.26
PWM_R_6
  Bottom 0.203: 144_TO_109.32 114.3,81.92 114.3,92.71 106.68,100.33 53.98,100.33 53.34,100.97 SV12.3
PWM_R_7
  Bottom 0.203: SV5.3 55.88,26.67 56.52,27.3 109.86,27.3 110.49,27.94 37_TO_72.3
PWM_R_8
  Bottom 0.203: SV6.3 90.81,24.77 91.44,25.4 113.67,25.4 114.3,26.04 114.3,31.11 37_TO_72.8
PWM_R_9
  Bottom 0.203: SV7.3 125.73,20.95 121.92,24.77 121.92,31.11 37_TO_72.12
REFP_0
  Top 0.203: U$3.4 174.93,110.95 ADC1_C1.1
REFP_1
  Top 0.203: ADC2_C1.1 191.64,9.7 U$6.4
RST  (1 unrouted)
  Top 0.203: 122.14,69.22 IC1.8 125.73,69.22 126.36,69.85 126.36,71.75 | U$4.3 125.73,71.75 126.36,71.75 | 113.67,73.66 110.49,73.66 109.86,74.3 109.86,76.83 101.5,85.19 RST.1 104.32,88.95 C25.1 | 113.67,73.66 125.09,73.66 126.36,72.39 126.36,71.75 | R1.1 113.51,73.81 113.67,73.66
RST_N  (via drill 0.6 pad 1)
  Top 0.203: U$2.39 39.75,61.77 v40.25,61.77
  Top 0.3: v55.5,62.77 R28.1
  Bottom 0.203: 55.5,61.77 55.5,61.76 | 55.5,61.76 55.5,61.72 | 55.5,61.76 55.5,62.99 42.04,62.99 41.06,61.77 v40.25,61.77
  Bottom 0.3: 55.5,61.77 v55.5,62.77
RX
  Top 0.203: SV2.1 83.19,41.27 93.34,41.27 95.89,38.73 104.14,38.73 1_TO_36.32
  Bottom 0.203: SV3.3 80.64,42.55 SV2.1
SCK_H  (via drill 0.6)
  Top 0.203: U$3.24 205.1,109.45 206.38,108.18 v206.38,98.42 205.1,97.16 190.5,97.16 189.87,97.79 189.87,101.6 189.23,102.23 165.1,102.23 164.47,101.6 153.03,101.6 137.16,85.72 137.16,81.92 144_TO_109.14 | v177.16,8.26 177.16,11.2 U$6.24
  Bottom 0.203: v177.16,8.26 207.01,8.26 207.65,8.89 207.65,85.09 206.38,86.36 v206.38,98.42
SCK_S
  Top 0.203: 1_TO_36.4 104.14,76.83 100.33,76.83 99.69,77.47 99.69,79.38 99.06,80.01 73.66,80.01 71.12,82.55 16.51,82.55 13.34,79.38 13.34,75.56 12.06,74.3 8.89,74.3 SV1.3 4.46,73.03 U$1.6
SCL_S  (via drill 0.41 pad 0.3, 0.6 pad 1.27)
  Top 0.203: 1_TO_36.2 102.23,81.28 74.93,81.28 70.48,85.72 36.83,85.72 | 36.83,85.72 7.77,85.72 | v7.62,81.92 7.62,85.72 7.77,85.72 | U$1.1 4.46,75.56 SV1.1 | v36.83,84.45 36.83,85.72 | R4.1 7.77,85.72 | U$2.43 37.75,60.29 v37.47,60.58
  Bottom 0.203: v7.62,81.92 SV1.1 | v37.47,60.58 37.47,83.82 v36.83,84.45
SDA_S  (via drill 0.41 pad 0.3, 0.6 pad 1.27)
  Top 0.203: 1_TO_36.1 100.33,80.64 74.3,80.64 71.75,83.19 39.37,83.19 | 39.37,83.19 11.43,83.19 10.16,81.92 10.16,78.74 | 10.16,78.74 SV1.2 8.89,76.83 3.81,76.83 3.17,76.2 3.16,76.2 U$1.3 | v39.37,84.45 39.37,83.19 | 10.16,78.74 5.08,78.74 3.81,80.01 R3.1 | U$2.42 38.25,60.35 v38.48,60.58
  Bottom 0.203: v38.48,60.58 38.48,83.57 v39.37,84.45
SIL10
  Top 0.203: SIL9.4 LED_2.A
SS_H_0
  Top 0.203: U$3.23 204.1,108.95 205.1,107.95 205.1,99.06 203.84,97.79 191.13,97.79 190.5,98.42 190.5,102.23 189.87,102.87 164.47,102.87 163.83,102.23 152.4,102.23 135.89,85.72 144_TO_109.13
SS_H_1  (via drill 0.6)
  Top 0.203: U$6.23 175.9,11.7 v175.9,9.53
  Bottom 0.203: v175.9,9.53 175.9,19.68 175.26,20.32 135.25,20.32 130.81,24.77 37_TO_72.19
SS_S
  Top 0.203: U$1.4 3.17,73.18 3.17,72.39 3.81,71.75 8.89,71.75 SV1.4 12.06,73.03 13.97,74.93 13.97,78.74 17.14,81.92 70.48,81.92 73.03,79.38 98.42,79.38 99.06,78.74 99.06,76.83 100.33,75.56 1_TO_36.3
SW_0  (via drill 0.6 pad 1.27)
  Top 0.203: v96.52,62.87 96.52,63.35 R13.2
  Bottom 0.203: 1_TO_36.13 v96.52,62.87
TCK
  Top 0.203: SV2.8 1_TO_36.35
TDI
  Top 0.203: SV2.5 83.19,36.2 104.14,36.2 1_TO_36.34
TDO
  Top 0.203: SV2.7 83.19,33.66 104.14,33.66 1_TO_36.36
TMS
  Top 0.203: SV2.6 1_TO_36.33
TX
  Top 0.203: SV2.2 93.34,42.55 95.89,40.01 1_TO_36.31
  Bottom 0.203: SV3.1 77.47,44.45 83.19,44.45 84.45,43.18 SV2.2
US_E_0
  Top 0.203: US_PR_0.1 161.29,85.72 73_TO_108.36
US_E_1
  Top 0.203: US_PR_1.1 161.29,80.64 158.75,78.11 73_TO_108.35
US_E_2
  Top 0.203: 73_TO_108.34 154.94,76.83 162.41,76.83 US_PR_2.1
US_E_3
  Top 0.203: 163.04,70.33 US_PR_3.1 161.93,70.48 161.29,71.12 161.29,74.93 160.66,75.56 73_TO_108.33
US_E_4
  Top 0.203: US_PR_4.1 205.74,85.72 206.38,85.09 206.38,64.14 205.74,63.5 161.29,63.5 158.75,66.04 158.75,69.85 158.12,70.48 73_TO_108.29
US_E_5
  Top 0.203: US_PR_5.1 205.1,80.64 205.74,80.01 205.74,64.77 205.1,64.14 161.93,64.14 159.38,66.67 159.38,71.12 158.75,71.75 154.94,71.75 73_TO_108.30
US_E_6
  Top 0.203: US_PR_6.1 204.47,75.56 205.1,74.93 205.1,65.41 204.47,64.77 162.56,64.77 160.02,67.31 160.02,72.39 159.38,73.03 73_TO_108.31
US_E_7
  Top 0.203: US_PR_7.1 201.93,69.7 201.93,66.04 201.29,65.41 163.19,65.41 160.66,67.94 160.66,73.66 160.02,74.3 154.94,74.3 73_TO_108.32
US_T_0
  Top 0.203: US_0.2 176.53,87 175.9,87.63 160.02,87.63 153.03,80.64 144_TO_109.2
US_T_1
  Top 0.203: US_1.2 176.53,80.01 177.16,80.64 180.97,80.64 181.61,81.28 181.61,87.63 180.97,88.27 159.38,88.27 154.31,83.19 144_TO_109.1
US_T_2
  Top 0.203: US_2.2 176.53,74.93 177.16,75.56 181.61,75.56 182.25,76.2 182.25,88.27 181.61,88.9 153.03,88.9 149.86,85.72 149.86,81.92 144_TO_109.4
US_T_3
  Top 0.203: US_3.2 176.53,69.85 177.16,70.48 182.25,70.48 182.88,71.12 182.88,88.9 182.25,89.53 150.5,89.53 148.59,87.63 144_TO_109.3
US_T_4
  Top 0.203: US_4.2 189.87,91.44 189.23,92.08 147.96,92.08 140.97,85.09 144_TO_109.9
US_T_5
  Top 0.203: US_5.2 189.87,80.01 189.23,80.64 185.42,80.64 184.78,81.28 184.78,90.81 184.15,91.44 148.59,91.44 142.24,85.09 142.24,81.92 144_TO_109.10
US_T_6
  Top 0.203: US_6.2 189.87,74.93 189.23,75.56 184.78,75.56 184.15,76.2 184.15,90.17 183.51,90.81 149.22,90.81 146.05,87.63 144_TO_109.5
US_T_7
  Top 0.203: US_7.2 189.87,69.85 189.23,70.48 184.15,70.48 183.51,71.12 183.51,89.53 182.88,90.17 149.86,90.17 147.32,87.63 147.32,81.92 144_TO_109.6
VCC  (via drill 0.6)
  Top 0.203: C8.1 24.5,41.77 | 173.44,110.45 U$3.5 173.4,110.45 173.35,110.49 v172.72,109.86 173.31,110.45 173.44,110.45 | 173.44,110.45 ADC1_C2.1 | U$3.21 186.06,107.95 187.32,106.68 ADC1_C3.1 v189.23,106.68 | U$6.21 175.26,12.7 173.35,10.79 | ADC2_C3.1 173.35,10.79 | ADC2_C2.1 191.64,10.2 U$6.5 191.77,10.2 191.77,13.34 196.22,13.34 196.85,12.7 | 196.85,12.7 196.85,3.17 196.22,2.54 173.99,2.54 173.35,3.17 173.35,10.79 | SV17.1 196.85,12.7
  Top 0.3: 24.5,41.77 R12.2 23.85,41.52 C28.1
  Top 0.406: L2.1 27.41,49.53
  Top 0.813: 27.41,49.53 19.68,49.53 19.05,48.9 19.05,22.86 19.68,22.23 177.8,22.23 | 177.8,22.23 ENC_5.1 | 177.8,22.23 208.91,22.23 209.55,21.59 209.55,13.34 208.91,12.7 SV16.1 SV17.1
  Top 1.3: L2.1 C8.1
  Bottom 0.813: US_0.1 US_4.1 | US_4.1 US_5.1 US_1.1 US_2.1 US_6.1 US_7.1 US_3.1 179.07,53.98 | 179.07,53.98 ENC_4.1 ENC_3.1 ENC_8.1 ENC_7.1 ENC_2.1 ENC_1.1 ENC_6.1 ENC_5.1 ENC_0.1 | 189.23,100.97 v189.23,106.68 188.59,107.31 188.59,112.39 187.96,113.03 175.9,113.03 175.26,112.39 175.26,110.49 174.62,109.86 v172.72,109.86 | US_4.1 187.32,86.36 189.23,97.79 189.23,100.97 | 189.23,100.97 SV14.1 SV15.1 | ENC_9.1 179.07,53.98
VCCINT  (via drill 0.6 pad 1.27)  (1 unrouted)
  Top 0.203: 1_TO_36.19 104.14,53.98 110.49,53.98 128.27,36.2 130.81,36.2 | 130.81,36.2 37_TO_72.20 | 149.86,55.24 73_TO_108.18 | 149.86,55.24 149.86,58.42 130.81,77.47 144_TO_109.18 | 149.86,55.24 149.86,52.7 133.35,36.2 130.81,36.2
  Top 0.8: L4.1 C50.2 52.75,64.52 R32.1 53.17,66.49 C48.2
  Bottom 0.813: 67.94,58.42 67.94,65.41 66.83,66.52 C48.2
  other vias: 53.15,66.52
VCCIO  (via drill 0.6, 0.6 pad 1.27)  (1 unrouted)
  Top 0.203: 25,71.02 C5.1 | 1_TO_36.9 104.14,66.67 106.68,66.67 107.31,66.04 107.31,60.96 107.95,60.33 108.58,60.33 | R4.2 7.62,88.9 | 108.58,60.33 IC1.20 IC1.1 122.56,60.33 123.19,60.96 123.19,67.31 123.83,67.94 126.36,67.94 127.64,69.22 127.64,72.39 125.09,74.93 118.11,74.93 118.11,76.83 | 144_TO_109.28 118.11,76.83 | R1.2 118.11,76.83 | U$3.28 181.28,111.45 180.97,111.76 180.97,114.81 ADC1_C4.1 | U$6.28 183.21,9.2 183.51,8.89 183.51,5.21 ADC2_C4.1 | 108.58,60.33 v108.58,58.42
  Top 0.3: R25.2 25,71.02
  Top 0.305: SV4.5 15.88,17.14 v50.8,17.14 v85.72,17.14 v120.65,17.14 v155.57,17.14 | v163.19,103.5 v128.27,103.5 v93.34,103.5 v58.42,103.5 v23.5,103.5 23.5,89.53 22.86,88.9 v20.32,88.9 | SV9.5 163.19,116.84 163.83,117.47 180.34,117.47 180.97,116.84 180.97,115.06 ADC1_C4.1 | v183.51,4.95 ADC2_C4.1
  Top 0.8: R25.2 25.1,71.02 C41.1
  Top 0.813: v20.32,67.59 C5.1 | R3.2 4.29,88.9 7.62,88.9 v20.32,88.9
  Top 1.3: L1.1 C5.1
  Bottom 0.203: 104.14,36.2 104.14,33.66 | 75.56,34.29 SV3.4 | 67.44,79.38 67.31,79.38 | 153.72,45.09 73_TO_108.10 149.86,45.09 | 149.86,36.83 149.86,45.09 | 73_TO_108.28 149.86,67.94 | 149.86,67.94 149.86,45.09 | 144_TO_109.8 143.51,76.83 149.86,76.83 149.86,67.94 | v108.58,58.42 108.58,36.2
  Bottom 0.254: 1_TO_36.25 104.14,46.35 104.14,36.2 108.58,36.2 118.11,36.2 | 104.14,33.66 102.87,32.38 77.47,32.38 75.56,34.29 | v120.65,17.14 120.65,23.5 119.38,24.77 119.38,31.11 37_TO_72.10 118.11,36.2 | 37_TO_72.28 140.97,36.2 | 140.97,36.2 118.11,36.2 | 140.97,36.2 149.22,36.2 149.86,36.83
  Bottom 0.305: v155.57,17.14 SV8.5 155.57,3.17 156.21,2.54 182.88,2.54 183.51,3.17 v183.51,4.95 | SV5.5 v50.8,17.14 | SV6.5 v85.72,17.14 | SV7.5 v120.65,17.14 | SV12.5 v58.42,103.5 | v163.19,103.5 SV9.5 | SV10.5 v128.27,103.5 | SV11.5 v93.34,103.5 | SV13.5 v23.5,103.5
  Bottom 0.813: SW_0.1 97.03,74.42 99.06,72.39 99.06,69.85 100.97,67.94 1_TO_36.9 | 67.31,79.38 67.31,88.9 v20.32,88.9 v20.32,67.59
VCORE
  Top 0.3: 53,47.02 C40.1
  Top 0.8: L3.1 C27.1 53,50.12 | 53.75,47.52 53.65,47.52 C40.1 53.67,47.02 R23.1
  Top 0.813: C27.1 53.75,47.52
VDDD  (via drill 0.6 pad 1)
  Top 0.203: U$2.20 38.75,45.52 | 38.75,45.52 38.75,44.27 44.25,44.27 C36.2 | v40.5,45.52 38.75,45.52 | 59,59.77 59,55.27 v58.94,55.37
  Top 0.3: R20.1 v36.25,45.52 | 59,59.77 58.42,59.77 R33.1 | R35.1 59,55.27 | R24.2 v27.25,66.02 | 28,46.02 28.08,46.02 R11.1 28,46.52 28,46.02
  Top 0.305: v28,44.27 28,46.02
  Top 0.8: R28.2 R33.1
  Bottom 0.203: 28,45.52 v36.25,45.52 v40.5,45.52 43.38,45.52 43.38,52.91 45.09,54.61 59.05,54.61 59.05,55.37 v58.94,55.37
  Bottom 0.3: v58.94,55.37 59,55.47 | v27.25,66.02 25.86,66.02 | 25.86,45.52 28,45.52
  Bottom 0.305: v28,44.27 28,45.52 | 25.86,66.02 25.86,45.52
VIN  (via drill 0.8 pad 1.27)
  Top 0.203: U$2.22 39.75,50.15 v40.5,49.4
  Top 0.3: U$2.30 41.75,55.52 41.75,56.02 U$2.31 41.25,56.02 41.25,55.52 U$2.30 | U$2.6 U$2.5 | U$2.5 34.25,56.52 34.25,56.27 34.25,56.02 | 34.25,56.02 34.75,56.02 34.75,56.52 U$2.5 | 34.25,56.02 34.3,56.26 29.27,56.27 | U$2.30 41.5,55.77
  Top 0.61: 34.25,56.27 29.27,56.27 | 29.27,56.27 22,56.27 | v29.27,57.77 29.27,56.27 | 41.5,55.77 v47.5,55.77
  Top 0.8: 22,56.08 C9.1 | 22,56.27 C9.1 | J3.3 14.45,56.52 14.9,56.27 | 21.5,56.27 C9.1
  Top 0.813: 14.9,56.27 21.5,56.27
  Bottom 0.61: v29.27,57.77 29.27,56.27 35,56.27 | 35,52.77 39.75,52.77 | v47.5,55.77 41,55.77 41,52.77 39.75,52.77 | 39.75,52.77 39.75,50.15 v40.5,49.4
  Bottom 0.8: 35,56.27 35,52.77